# Altium project KlusterLab r2.0.PrjPcb (part 3 of 10)

## Sheet DDR3 Memory_SO-DIMM.SchDoc
size A3
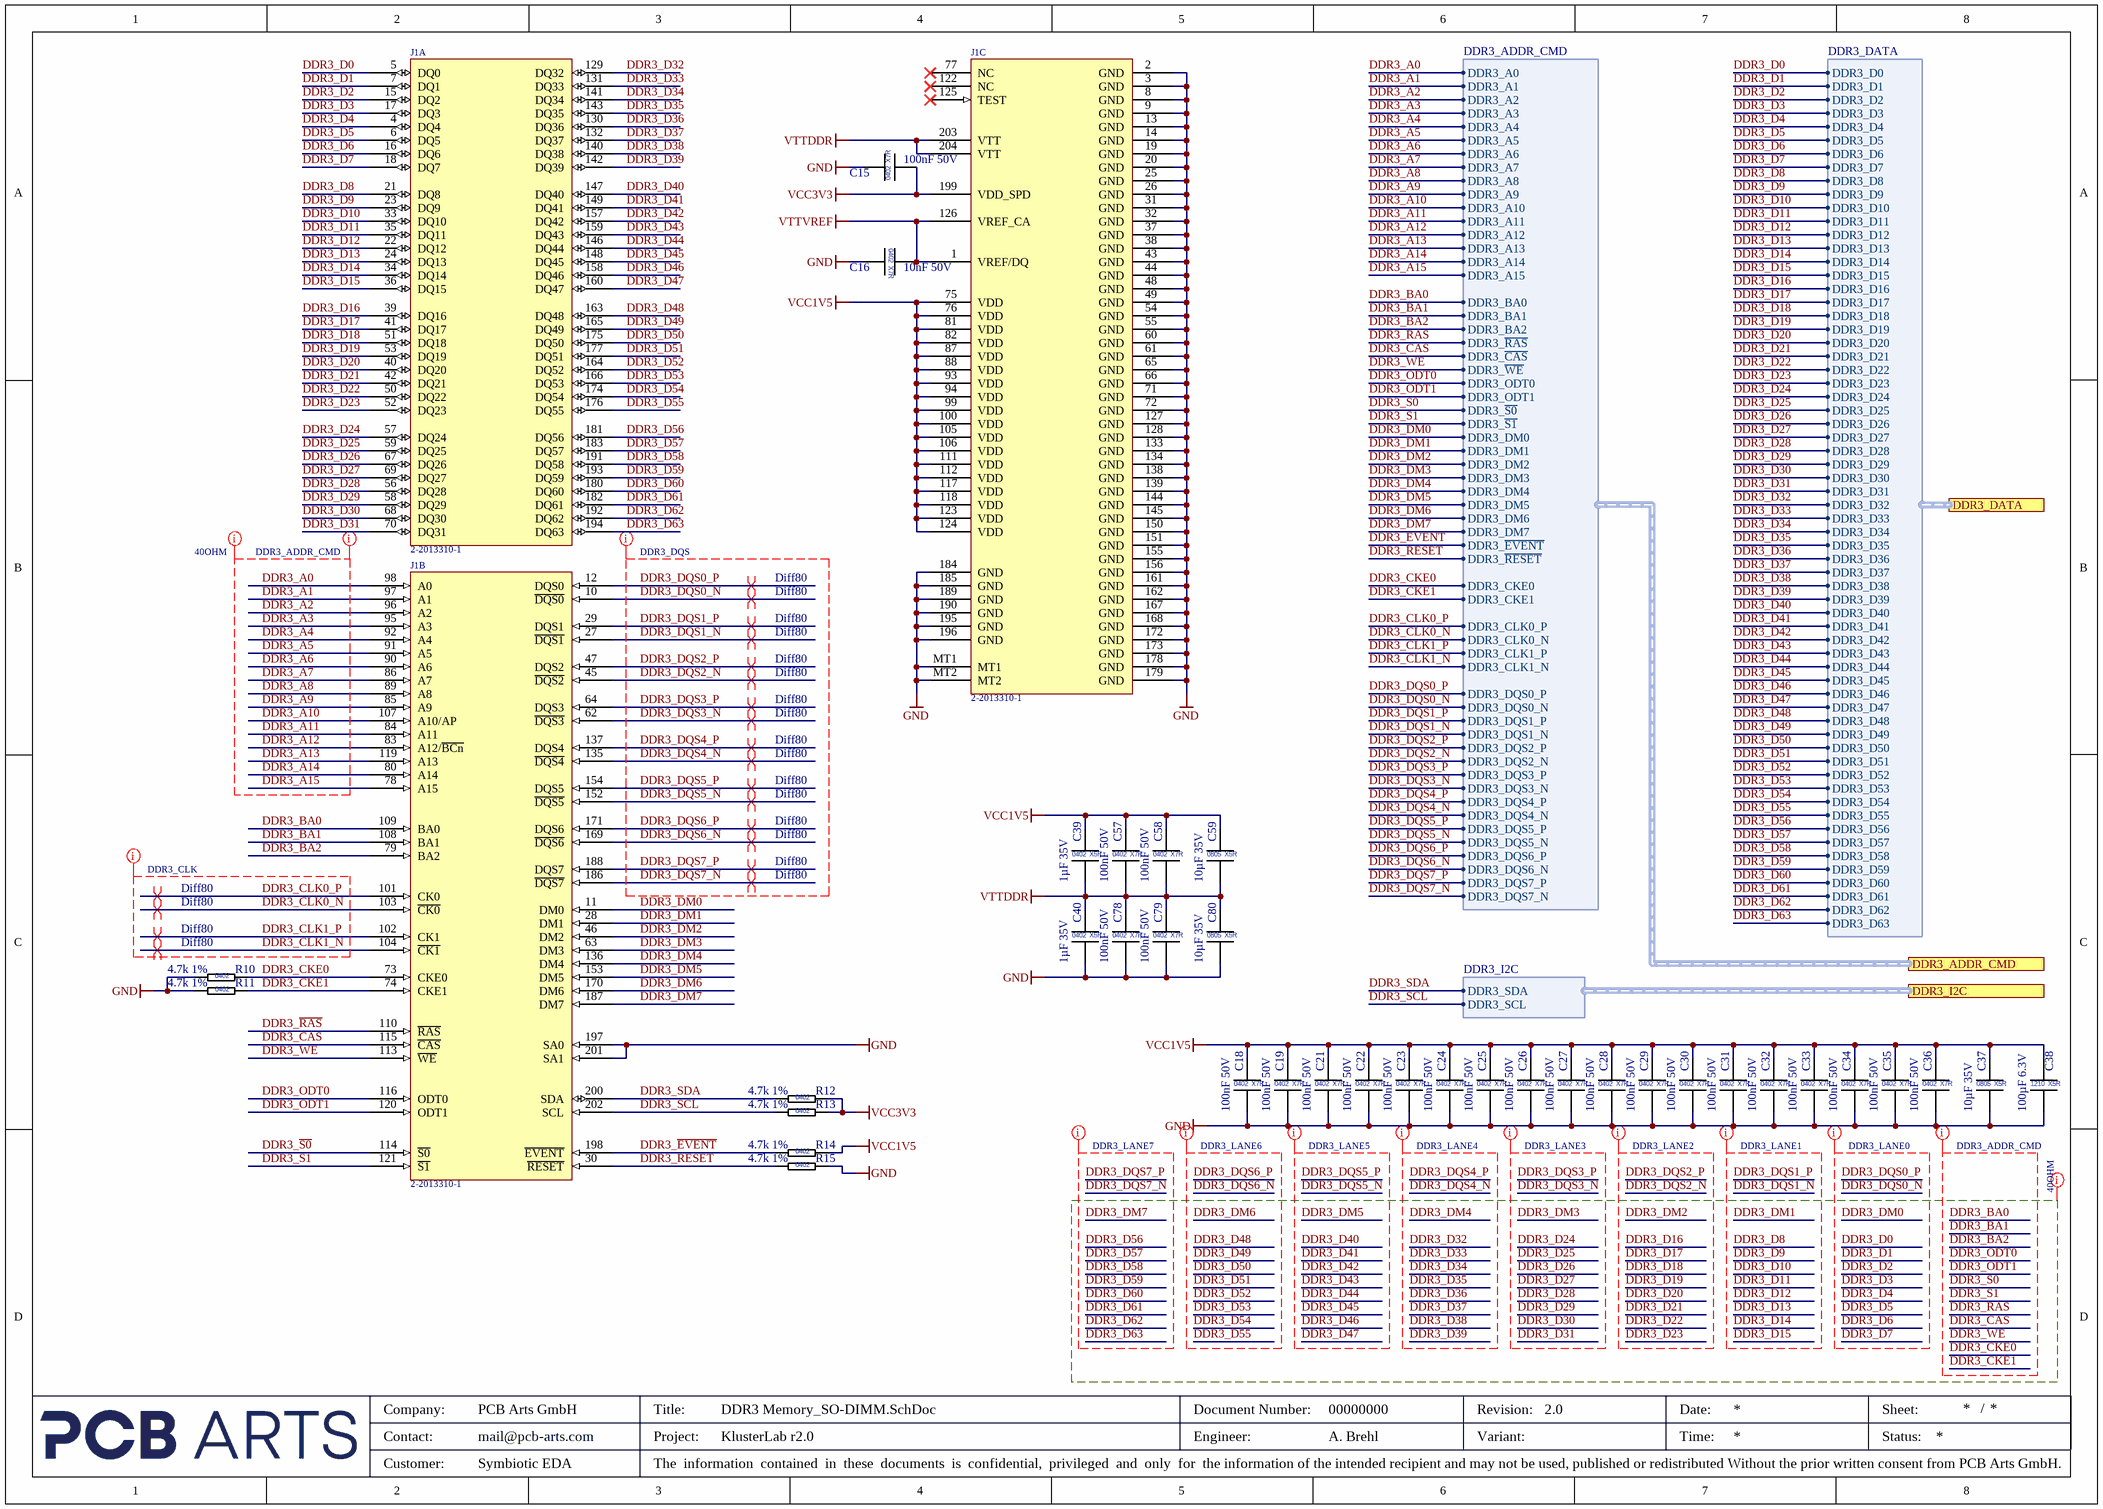
[diagram p4: DDR3 Memory_SO-DIMM.SchDoc]

### Parts
C15  100nF 50V  [CAP_0402_L]
C16  10nF 50V  [CAP_0402_L]
C18  100nF 50V  [CAP_0402_L]
C19  100nF 50V  [CAP_0402_L]
C21  100nF 50V  [CAP_0402_L]
C22  100nF 50V  [CAP_0402_L]
C23  100nF 50V  [CAP_0402_L]
C24  100nF 50V  [CAP_0402_L]
C25  100nF 50V  [CAP_0402_L]
C26  100nF 50V  [CAP_0402_L]
C27  100nF 50V  [CAP_0402_L]
C28  100nF 50V  [CAP_0402_L]
C29  100nF 50V  [CAP_0402_L]
C30  100nF 50V  [CAP_0402_L]
C31  100nF 50V  [CAP_0402_L]
C32  100nF 50V  [CAP_0402_L]
C33  100nF 50V  [CAP_0402_L]
C34  100nF 50V  [CAP_0402_L]
C35  100nF 50V  [CAP_0402_L]
C36  100nF 50V  [CAP_0402_L]
C37  10µF 35V  [CAP_0805]
C38  100µF 6.3V  [CAP_1210]
C39  1µF 35V  [CAP_0402_L]
C40  1µF 35V  [CAP_0402_L]
C57  100nF 50V  [CAP_0402_L]
C58  100nF 50V  [CAP_0402_L]
C59  10µF 35V  [CAP_0805]
C78  100nF 50V  [CAP_0402_L]
C79  100nF 50V  [CAP_0402_L]
C80  10µF 35V  [CAP_0805]
J1  2-2013310-1  [2-2013310-1]  (parts A,B,C of 3)
R10  4.7k 1%  [RES_0402_L]
R11  4.7k 1%  [RES_0402_L]
R12  4.7k 1%  [RES_0402_L]
R13  4.7k 1%  [RES_0402_L]
R14  4.7k 1%  [RES_0402_L]
R15  4.7k 1%  [RES_0402_L]

### Ports
DDR3_ADDR_CMD (harness DDR3_ADDR_CMD, see Top-Level-Sheet[6B], DDR3 Memory_Banks 32-33-34[8C]), DDR3_DATA (harness DDR3_DATA, see Top-Level-Sheet[6B], DDR3 Memory_Banks 32-33-34[8B]), DDR3_I2C (harness DDR3_I2C, see Top-Level-Sheet[6B], I2C Multiplexer[7A])

### Harnesses
DDR3_DATA: DDR3_D0, DDR3_D1, DDR3_D2, DDR3_D3, DDR3_D4, DDR3_D5, DDR3_D6, DDR3_D7, DDR3_D8, DDR3_D9, DDR3_D10, DDR3_D11, DDR3_D12, DDR3_D13, DDR3_D14, DDR3_D15, DDR3_D16, DDR3_D17, DDR3_D18, DDR3_D19, DDR3_D20, DDR3_D21, DDR3_D22, DDR3_D23, DDR3_D24, DDR3_D25, DDR3_D26, DDR3_D27, DDR3_D28, DDR3_D29, DDR3_D30, DDR3_D31, DDR3_D32, DDR3_D33, DDR3_D34, DDR3_D35, DDR3_D36, DDR3_D37, DDR3_D38, DDR3_D39, DDR3_D40, DDR3_D41, DDR3_D42, DDR3_D43, DDR3_D44, DDR3_D45, DDR3_D46, DDR3_D47, DDR3_D48, DDR3_D49, DDR3_D50, DDR3_D51, DDR3_D52, DDR3_D53, DDR3_D54, DDR3_D55, DDR3_D56, DDR3_D57, DDR3_D58, DDR3_D59, DDR3_D60, DDR3_D61, DDR3_D62, DDR3_D63
DDR3_ADDR_CMD: DDR3_A0, DDR3_BA0, DDR3_BA1, DDR3_BA2, DDR3_~{RAS}, DDR3_~{CAS}, DDR3_~{WE}, DDR3_ODT0, DDR3_ODT1, DDR3_~{S0}, DDR3_~{S1}, DDR3_DM0, DDR3_~{EVENT}, DDR3_~{RESET}, DDR3_CKE0, DDR3_CKE1, DDR3_CLK0_P, DDR3_CLK0_N, DDR3_CLK1_P, DDR3_CLK1_N, DDR3_DQS0_P, DDR3_DQS0_N, DDR3_DQS1_P, DDR3_DQS1_N, DDR3_DQS2_P, DDR3_DQS2_N, DDR3_DQS3_P, DDR3_DQS3_N, DDR3_DQS4_P, DDR3_DQS4_N, DDR3_DQS5_P, DDR3_DQS5_N, DDR3_DQS6_P, DDR3_DQS6_N, DDR3_DQS7_P, DDR3_DQS7_N, DDR3_A1, DDR3_A2, DDR3_A3, DDR3_A4, DDR3_A5, DDR3_A6, DDR3_A7, DDR3_A8, DDR3_A9, DDR3_A10, DDR3_A11, DDR3_A12, DDR3_A13, DDR3_A14, DDR3_A15, DDR3_DM1, DDR3_DM2, DDR3_DM3, DDR3_DM4, DDR3_DM5, DDR3_DM6, DDR3_DM7
DDR3_I2C: DDR3_SDA, DDR3_SCL

### Nets
GND: C15.1 C16.2 C18.2 C19.2 C21.2 C22.2 C23.2 C24.2 C25.2 C26.2 C27.2 C28.2 C29.2 C30.2 C31.2 C32.2 C33.2 C34.2 C35.2 C36.2 C37.2 C38.2 C40.2 C78.2 C79.2 C80.2 J1.2(GND) J1.3(GND) J1.8(GND) J1.9(GND) J1.13(GND) J1.14(GND) J1.19(GND) J1.20(GND) J1.25(GND) J1.26(GND) J1.31(GND) J1.32(GND) J1.37(GND) J1.38(GND) J1.43(GND) J1.44(GND) J1.48(GND) J1.49(GND) J1.54(GND) J1.55(GND) J1.60(GND) J1.61(GND) J1.65(GND) J1.66(GND) J1.71(GND) J1.72(GND) J1.127(GND) J1.128(GND) J1.133(GND) J1.134(GND) J1.138(GND) J1.139(GND) J1.144(GND) J1.145(GND) J1.150(GND) J1.151(GND) J1.155(GND) J1.156(GND) J1.161(GND) J1.162(GND) J1.167(GND) J1.168(GND) J1.172(GND) J1.173(GND) J1.178(GND) J1.179(GND) J1.184(GND) J1.185(GND) J1.189(GND) J1.190(GND) J1.195(GND) J1.196(GND) J1.197(SA0) J1.201(SA1) J1.MT1 J1.MT2 R10.1 R11.1 R15.2
VCC1V5: C18.1 C19.1 C21.1 C22.1 C23.1 C24.1 C25.1 C26.1 C27.1 C28.1 C29.1 C30.1 C31.1 C32.1 C33.1 C34.1 C35.1 C36.1 C37.1 C38.1 C39.1 C57.1 C58.1 C59.1 J1.75(VDD) J1.76(VDD) J1.81(VDD) J1.82(VDD) J1.87(VDD) J1.88(VDD) J1.93(VDD) J1.94(VDD) J1.99(VDD) J1.100(VDD) J1.105(VDD) J1.106(VDD) J1.111(VDD) J1.112(VDD) J1.117(VDD) J1.118(VDD) J1.123(VDD) J1.124(VDD) R14.2
VCC3V3: C15.2 J1.199(VDD_SPD) R12.2 R13.2
VTTDDR: C39.2 C40.1 C57.2 C58.2 C59.2 C78.1 C79.1 C80.1 J1.203(VTT) J1.204(VTT)
VTTVREF: C16.1 J1.1(VREF/DQ) J1.126(VREF_CA)
DDR3_A0: J1.98(A0) ; port DDR3_ADDR_CMD.DDR3_A0
DDR3_A1: J1.97(A1) ; port DDR3_ADDR_CMD.DDR3_A1
DDR3_A2: J1.96(A2) ; port DDR3_ADDR_CMD.DDR3_A2
DDR3_A3: J1.95(A3) ; port DDR3_ADDR_CMD.DDR3_A3
DDR3_A4: J1.92(A4) ; port DDR3_ADDR_CMD.DDR3_A4
DDR3_A5: J1.91(A5) ; port DDR3_ADDR_CMD.DDR3_A5
DDR3_A6: J1.90(A6) ; port DDR3_ADDR_CMD.DDR3_A6
DDR3_A7: J1.86(A7) ; port DDR3_ADDR_CMD.DDR3_A7
DDR3_A8: J1.89(A8) ; port DDR3_ADDR_CMD.DDR3_A8
DDR3_A9: J1.85(A9) ; port DDR3_ADDR_CMD.DDR3_A9
DDR3_A10: J1.107(A10/AP) ; port DDR3_ADDR_CMD.DDR3_A10
DDR3_A11: J1.84(A11) ; port DDR3_ADDR_CMD.DDR3_A11
DDR3_A12: J1.83(A12/~{BCn}) ; port DDR3_ADDR_CMD.DDR3_A12
DDR3_A13: J1.119(A13) ; port DDR3_ADDR_CMD.DDR3_A13
DDR3_A14: J1.80(A14) ; port DDR3_ADDR_CMD.DDR3_A14
DDR3_A15: J1.78(A15) ; port DDR3_ADDR_CMD.DDR3_A15
DDR3_BA0: J1.109(BA0) ; port DDR3_ADDR_CMD.DDR3_BA0
DDR3_BA1: J1.108(BA1) ; port DDR3_ADDR_CMD.DDR3_BA1
DDR3_BA2: J1.79(BA2) ; port DDR3_ADDR_CMD.DDR3_BA2
DDR3_~{CAS}: J1.115(~{CAS}) ; port DDR3_ADDR_CMD.DDR3_~{CAS}
DDR3_CKE0: J1.73(CKE0) R10.2 ; port DDR3_ADDR_CMD.DDR3_CKE0
DDR3_CKE1: J1.74(CKE1) R11.2 ; port DDR3_ADDR_CMD.DDR3_CKE1
DDR3_CLK0_N: J1.103(~{CK0}) ; port DDR3_ADDR_CMD.DDR3_CLK0_N
DDR3_CLK0_P: J1.101(CK0) ; port DDR3_ADDR_CMD.DDR3_CLK0_P
DDR3_CLK1_N: J1.104(~{CK1}) ; port DDR3_ADDR_CMD.DDR3_CLK1_N
DDR3_CLK1_P: J1.102(CK1) ; port DDR3_ADDR_CMD.DDR3_CLK1_P
DDR3_D0: J1.5(DQ0) ; port DDR3_DATA.DDR3_D0
DDR3_D1: J1.7(DQ1) ; port DDR3_DATA.DDR3_D1
DDR3_D2: J1.15(DQ2) ; port DDR3_DATA.DDR3_D2
DDR3_D3: J1.17(DQ3) ; port DDR3_DATA.DDR3_D3
DDR3_D4: J1.4(DQ4) ; port DDR3_DATA.DDR3_D4
DDR3_D5: J1.6(DQ5) ; port DDR3_DATA.DDR3_D5
DDR3_D6: J1.16(DQ6) ; port DDR3_DATA.DDR3_D6
DDR3_D7: J1.18(DQ7) ; port DDR3_DATA.DDR3_D7
DDR3_D8: J1.21(DQ8) ; port DDR3_DATA.DDR3_D8
DDR3_D9: J1.23(DQ9) ; port DDR3_DATA.DDR3_D9
DDR3_D10: J1.33(DQ10) ; port DDR3_DATA.DDR3_D10
DDR3_D11: J1.35(DQ11) ; port DDR3_DATA.DDR3_D11
DDR3_D12: J1.22(DQ12) ; port DDR3_DATA.DDR3_D12
DDR3_D13: J1.24(DQ13) ; port DDR3_DATA.DDR3_D13
DDR3_D14: J1.34(DQ14) ; port DDR3_DATA.DDR3_D14
DDR3_D15: J1.36(DQ15) ; port DDR3_DATA.DDR3_D15
DDR3_D16: J1.39(DQ16) ; port DDR3_DATA.DDR3_D16
DDR3_D17: J1.41(DQ17) ; port DDR3_DATA.DDR3_D17
DDR3_D18: J1.51(DQ18) ; port DDR3_DATA.DDR3_D18
DDR3_D19: J1.53(DQ19) ; port DDR3_DATA.DDR3_D19
DDR3_D20: J1.40(DQ20) ; port DDR3_DATA.DDR3_D20
DDR3_D21: J1.42(DQ21) ; port DDR3_DATA.DDR3_D21
DDR3_D22: J1.50(DQ22) ; port DDR3_DATA.DDR3_D22
DDR3_D23: J1.52(DQ23) ; port DDR3_DATA.DDR3_D23
DDR3_D24: J1.57(DQ24) ; port DDR3_DATA.DDR3_D24
DDR3_D25: J1.59(DQ25) ; port DDR3_DATA.DDR3_D25
DDR3_D26: J1.67(DQ26) ; port DDR3_DATA.DDR3_D26
DDR3_D27: J1.69(DQ27) ; port DDR3_DATA.DDR3_D27
DDR3_D28: J1.56(DQ28) ; port DDR3_DATA.DDR3_D28
DDR3_D29: J1.58(DQ29) ; port DDR3_DATA.DDR3_D29
DDR3_D30: J1.68(DQ30) ; port DDR3_DATA.DDR3_D30
DDR3_D31: J1.70(DQ31) ; port DDR3_DATA.DDR3_D31
DDR3_D32: J1.129(DQ32) ; port DDR3_DATA.DDR3_D32
DDR3_D33: J1.131(DQ33) ; port DDR3_DATA.DDR3_D33
DDR3_D34: J1.141(DQ34) ; port DDR3_DATA.DDR3_D34
DDR3_D35: J1.143(DQ35) ; port DDR3_DATA.DDR3_D35
DDR3_D36: J1.130(DQ36) ; port DDR3_DATA.DDR3_D36
DDR3_D37: J1.132(DQ37) ; port DDR3_DATA.DDR3_D37
DDR3_D38: J1.140(DQ38) ; port DDR3_DATA.DDR3_D38
DDR3_D39: J1.142(DQ39) ; port DDR3_DATA.DDR3_D39
DDR3_D40: J1.147(DQ40) ; port DDR3_DATA.DDR3_D40
DDR3_D41: J1.149(DQ41) ; port DDR3_DATA.DDR3_D41
DDR3_D42: J1.157(DQ42) ; port DDR3_DATA.DDR3_D42
DDR3_D43: J1.159(DQ43) ; port DDR3_DATA.DDR3_D43
DDR3_D44: J1.146(DQ44) ; port DDR3_DATA.DDR3_D44
DDR3_D45: J1.148(DQ45) ; port DDR3_DATA.DDR3_D45
DDR3_D46: J1.158(DQ46) ; port DDR3_DATA.DDR3_D46
DDR3_D47: J1.160(DQ47) ; port DDR3_DATA.DDR3_D47
DDR3_D48: J1.163(DQ48) ; port DDR3_DATA.DDR3_D48
DDR3_D49: J1.165(DQ49) ; port DDR3_DATA.DDR3_D49
DDR3_D50: J1.175(DQ50) ; port DDR3_DATA.DDR3_D50
DDR3_D51: J1.177(DQ51) ; port DDR3_DATA.DDR3_D51
DDR3_D52: J1.164(DQ52) ; port DDR3_DATA.DDR3_D52
DDR3_D53: J1.166(DQ53) ; port DDR3_DATA.DDR3_D53
DDR3_D54: J1.174(DQ54) ; port DDR3_DATA.DDR3_D54
DDR3_D55: J1.176(DQ55) ; port DDR3_DATA.DDR3_D55
DDR3_D56: J1.181(DQ56) ; port DDR3_DATA.DDR3_D56
DDR3_D57: J1.183(DQ57) ; port DDR3_DATA.DDR3_D57
DDR3_D58: J1.191(DQ58) ; port DDR3_DATA.DDR3_D58
DDR3_D59: J1.193(DQ59) ; port DDR3_DATA.DDR3_D59
DDR3_D60: J1.180(DQ60) ; port DDR3_DATA.DDR3_D60
DDR3_D61: J1.182(DQ61) ; port DDR3_DATA.DDR3_D61
DDR3_D62: J1.192(DQ62) ; port DDR3_DATA.DDR3_D62
DDR3_D63: J1.194(DQ63) ; port DDR3_DATA.DDR3_D63
DDR3_DM0: J1.11(DM0) ; port DDR3_ADDR_CMD.DDR3_DM0
DDR3_DM1: J1.28(DM1) ; port DDR3_ADDR_CMD.DDR3_DM1
DDR3_DM2: J1.46(DM2) ; port DDR3_ADDR_CMD.DDR3_DM2
DDR3_DM3: J1.63(DM3) ; port DDR3_ADDR_CMD.DDR3_DM3
DDR3_DM4: J1.136(DM4) ; port DDR3_ADDR_CMD.DDR3_DM4
DDR3_DM5: J1.153(DM5) ; port DDR3_ADDR_CMD.DDR3_DM5
DDR3_DM6: J1.170(DM6) ; port DDR3_ADDR_CMD.DDR3_DM6
DDR3_DM7: J1.187(DM7) ; port DDR3_ADDR_CMD.DDR3_DM7
DDR3_DQS0_N: J1.10(~{DQS0}) ; port DDR3_ADDR_CMD.DDR3_DQS0_N
DDR3_DQS0_P: J1.12(DQS0) ; port DDR3_ADDR_CMD.DDR3_DQS0_P
DDR3_DQS1_N: J1.27(~{DQS1}) ; port DDR3_ADDR_CMD.DDR3_DQS1_N
DDR3_DQS1_P: J1.29(DQS1) ; port DDR3_ADDR_CMD.DDR3_DQS1_P
DDR3_DQS2_N: J1.45(~{DQS2}) ; port DDR3_ADDR_CMD.DDR3_DQS2_N
DDR3_DQS2_P: J1.47(DQS2) ; port DDR3_ADDR_CMD.DDR3_DQS2_P
DDR3_DQS3_N: J1.62(~{DQS3}) ; port DDR3_ADDR_CMD.DDR3_DQS3_N
DDR3_DQS3_P: J1.64(DQS3) ; port DDR3_ADDR_CMD.DDR3_DQS3_P
DDR3_DQS4_N: J1.135(~{DQS4}) ; port DDR3_ADDR_CMD.DDR3_DQS4_N
DDR3_DQS4_P: J1.137(DQS4) ; port DDR3_ADDR_CMD.DDR3_DQS4_P
DDR3_DQS5_N: J1.152(~{DQS5}) ; port DDR3_ADDR_CMD.DDR3_DQS5_N
DDR3_DQS5_P: J1.154(DQS5) ; port DDR3_ADDR_CMD.DDR3_DQS5_P
DDR3_DQS6_N: J1.169(~{DQS6}) ; port DDR3_ADDR_CMD.DDR3_DQS6_N
DDR3_DQS6_P: J1.171(DQS6) ; port DDR3_ADDR_CMD.DDR3_DQS6_P
DDR3_DQS7_N: J1.186(~{DQS7}) ; port DDR3_ADDR_CMD.DDR3_DQS7_N
DDR3_DQS7_P: J1.188(DQS7) ; port DDR3_ADDR_CMD.DDR3_DQS7_P
DDR3_~{EVENT}: J1.198(~{EVENT}) R14.1 ; port DDR3_ADDR_CMD.DDR3_~{EVENT}
DDR3_ODT0: J1.116(ODT0) ; port DDR3_ADDR_CMD.DDR3_ODT0
DDR3_ODT1: J1.120(ODT1) ; port DDR3_ADDR_CMD.DDR3_ODT1
DDR3_~{RAS}: J1.110(~{RAS}) ; port DDR3_ADDR_CMD.DDR3_~{RAS}
DDR3_~{RESET}: J1.30(~{RESET}) R15.1 ; port DDR3_ADDR_CMD.DDR3_~{RESET}
DDR3_~{S0}: J1.114(~{S0}) ; port DDR3_ADDR_CMD.DDR3_~{S0}
DDR3_~{S1}: J1.121(~{S1}) ; port DDR3_ADDR_CMD.DDR3_~{S1}
DDR3_SCL: J1.202(SCL) R13.1 ; port DDR3_I2C.DDR3_SCL
DDR3_SDA: J1.200(SDA) R12.1 ; port DDR3_I2C.DDR3_SDA
DDR3_~{WE}: J1.113(~{WE}) ; port DDR3_ADDR_CMD.DDR3_~{WE}

Not connected (* = marked no-connect by the designer): J1 77(NC)* 122(NC)* 125(TEST)*

### Layout directives
differential pair; net class Diff80: DDR3_CLK0_N, DDR3_CLK0_P, DDR3_CLK1_N, DDR3_CLK1_P, DDR3_DQS0_N, DDR3_DQS0_P, DDR3_DQS1_N, DDR3_DQS1_P, DDR3_DQS2_N, DDR3_DQS2_P, DDR3_DQS3_N, DDR3_DQS3_P, DDR3_DQS4_N, DDR3_DQS4_P, DDR3_DQS5_N, DDR3_DQS5_P, DDR3_DQS6_N, DDR3_DQS6_P, DDR3_DQS7_N, DDR3_DQS7_P
net class DDR3_DQS: DDR3_DQS0_N, DDR3_DQS0_P, DDR3_DQS1_N, DDR3_DQS1_P, DDR3_DQS2_N, DDR3_DQS2_P, DDR3_DQS3_N, DDR3_DQS3_P, DDR3_DQS4_N, DDR3_DQS4_P, DDR3_DQS5_N, DDR3_DQS5_P, DDR3_DQS6_N, DDR3_DQS6_P, DDR3_DQS7_N, DDR3_DQS7_P
net class DDR3_LANE1: DDR3_D8, DDR3_D9, DDR3_D10, DDR3_D11, DDR3_D12, DDR3_D13, DDR3_D14, DDR3_D15, DDR3_DM1, DDR3_DQS1_N, DDR3_DQS1_P
net class DDR3_LANE2: DDR3_D16, DDR3_D17, DDR3_D18, DDR3_D19, DDR3_D20, DDR3_D21, DDR3_D22, DDR3_D23, DDR3_DM2, DDR3_DQS2_N, DDR3_DQS2_P
net class DDR3_LANE3: DDR3_D24, DDR3_D25, DDR3_D26, DDR3_D27, DDR3_D28, DDR3_D29, DDR3_D30, DDR3_D31, DDR3_DM3, DDR3_DQS3_N, DDR3_DQS3_P
net class DDR3_LANE4: DDR3_D32, DDR3_D33, DDR3_D34, DDR3_D35, DDR3_D36, DDR3_D37, DDR3_D38, DDR3_D39, DDR3_DM4, DDR3_DQS4_N, DDR3_DQS4_P
net class DDR3_LANE5: DDR3_D40, DDR3_D41, DDR3_D42, DDR3_D43, DDR3_D44, DDR3_D45, DDR3_D46, DDR3_D47, DDR3_DM5, DDR3_DQS5_N, DDR3_DQS5_P
net class DDR3_LANE6: DDR3_D48, DDR3_D49, DDR3_D50, DDR3_D51, DDR3_D52, DDR3_D53, DDR3_D54, DDR3_D55, DDR3_DM6, DDR3_DQS6_N, DDR3_DQS6_P
net class DDR3_LANE7: DDR3_D56, DDR3_D57, DDR3_D58, DDR3_D59, DDR3_D60, DDR3_D61, DDR3_D62, DDR3_D63, DDR3_DM7, DDR3_DQS7_N, DDR3_DQS7_P
net class 40OHM: DDR3_A0, DDR3_A1, DDR3_A2, DDR3_A3, DDR3_A4, DDR3_A5, DDR3_A6, DDR3_A7, DDR3_A8, DDR3_A9, DDR3_A10, DDR3_A11, DDR3_A12, DDR3_A13, DDR3_A14, DDR3_A15, DDR3_BA0, DDR3_BA1, DDR3_BA2, DDR3_CKE0, DDR3_CKE1, DDR3_D0, DDR3_D1, DDR3_D2, DDR3_D3, DDR3_D4, DDR3_D5, DDR3_D6, DDR3_D7, DDR3_D8, DDR3_D9, DDR3_D10, DDR3_D11, DDR3_D12, DDR3_D13, DDR3_D14, DDR3_D15, DDR3_D16, DDR3_D17, DDR3_D18, DDR3_D19, DDR3_D20, DDR3_D21, DDR3_D22, DDR3_D23, DDR3_D24, DDR3_D25, DDR3_D26, DDR3_D27, DDR3_D28, DDR3_D29, DDR3_D30, DDR3_D31, DDR3_D32, DDR3_D33, DDR3_D34, DDR3_D35, DDR3_D36, DDR3_D37, DDR3_D38, DDR3_D39, DDR3_D40, DDR3_D41, DDR3_D42, DDR3_D43, DDR3_D44, DDR3_D45, DDR3_D46, DDR3_D47, DDR3_D48, DDR3_D49, DDR3_D50, DDR3_D51, DDR3_D52, DDR3_D53, DDR3_D54, DDR3_D55, DDR3_D56, DDR3_D57, DDR3_D58, DDR3_D59, DDR3_D60, DDR3_D61, DDR3_D62, DDR3_D63, DDR3_DM0, DDR3_DM1, DDR3_DM2, DDR3_DM3, DDR3_DM4, DDR3_DM5, DDR3_DM6, DDR3_DM7, DDR3_ODT0, DDR3_ODT1, DDR3_~{CAS}, DDR3_~{RAS}, DDR3_~{S0}, DDR3_~{S1}, DDR3_~{WE}
net class DDR3_ADDR_CMD: DDR3_A0, DDR3_A1, DDR3_A2, DDR3_A3, DDR3_A4, DDR3_A5, DDR3_A6, DDR3_A7, DDR3_A8, DDR3_A9, DDR3_A10, DDR3_A11, DDR3_A12, DDR3_A13, DDR3_A14, DDR3_A15, DDR3_BA0, DDR3_BA1, DDR3_BA2, DDR3_CKE0, DDR3_CKE1, DDR3_ODT0, DDR3_ODT1, DDR3_~{CAS}, DDR3_~{RAS}, DDR3_~{S0}, DDR3_~{S1}, DDR3_~{WE}
net class DDR3_CLK: DDR3_CLK0_N, DDR3_CLK0_P, DDR3_CLK1_N, DDR3_CLK1_P
net class DDR3_LANE0: DDR3_D0, DDR3_D1, DDR3_D2, DDR3_D3, DDR3_D4, DDR3_D5, DDR3_D6, DDR3_D7, DDR3_DM0, DDR3_DQS0_N, DDR3_DQS0_P

### Notes on the sheet
- Company:
- Contact:
- Customer:
- mail@pcb-arts.com
- PCB Arts GmbH
- Title:
- Project:
- The  information  contained  in  these  documents  is  confidential,  privileged  and  only  for  the information of the intended recipient and may not be used, published or redistributed Without the prior written consent from PCB Arts GmbH.
- Engineer:
- Document Number:
- Revision:
- Variant:
- Date:
- Time:
- Sheet:
- Status:
- /
- (in symbol CAP_0402_1µF_35V) 0402; X5R
- (in symbol CAP_0402_10nF_50V) 0402; X7R
- (in symbol CAP_0402_100nF_50V) 0402; X7R
- (in symbol CAP_0805_10µF_35V) 0805; X5R
- (in symbol CAP_1210_100µF_6.3V) 1210; X5R
- (in symbol RES_0402_4.7k_1%) 0402

### Library data of the parts
C15 C18 C19 C21-C36 C57 C58 C78 C79 = CAP_0402_100nF_50V: Multilayer Ceramic Capacitors MLCC - SMD/SMT 0402 50VDC; Manufacturer 1: Murata Electronics; Manufacturer 1 Prt. Nr.: GCM155L8EH104KE07D; Manufacturer 2 Prt. Nr.: UMK105B7104KV-FR; Manufacturer 2: TDK
C16 = CAP_0402_10nF_50V: Multilayer Ceramic Capacitors MLCC - SMD/SMT 0402 50VDC; Manufacturer 1: Wurth Elektronik; Manufacturer 1 Prt. Nr.: 885012205067; Manufacturer 2 Prt. Nr.: AC0402KPX7R9BB103; Manufacturer 2: Yageo
C37 C59 C80 = CAP_0805_10µF_35V: Multilayer Ceramic Capacitors MLCC - SMD/SMT 0805 35VDC; Manufacturer 1: Murata Electronics; Manufacturer 1 Prt. Nr.: GRM21BR6YA106ME43L; Manufacturer 2 Prt. Nr.: C2012X5R1V106M085AC; Manufacturer 2: TDK
C38 = CAP_1210_100µF_6.3V: Multilayer Ceramic Capacitors MLCC - SMD/SMT 1210 6.3VDC; Manufacturer 1: Samsung Electro-Mechanics; Manufacturer 1 Prt. Nr.: CL32A107MQVNNWE; Manufacturer 2 Prt. Nr.: JMK325ABJ107MMHP; Manufacturer 2: Taiyo Yuden
C39 C40 = CAP_0402_1µF_35V: Multilayer Ceramic Capacitors MLCC - SMD/SMT 0402 35VDC; Manufacturer 1: Kyocera Electronic Components; Manufacturer 1 Prt. Nr.: CM05X5R105K35AH; Manufacturer 2 Prt. Nr.: C1005X5R1V105K050BC; Manufacturer 2: TDK
J1 = 2-2013310-1_SO-DIMM DDR3 204P 9.2H STD Connector: SO-DIMM DDR3 204P 9.2H STD Connector; Manufacturer 1: TE Connectivity; Manufacturer 1 Prt. Nr.: 2-2013310-1
R10-R15 = RES_0402_4.7k_1%: Thick Film Resistors - SMD 4.7kOhm 1%; Manufacturer 1: Vishay / Dale; Manufacturer 1 Prt. Nr.: CRCW04024K70FKEDC; Manufacturer 2 Prt. Nr.: RC0402FR-134K7L; Manufacturer 2: Yageo

## Sheet FPGA_HDMI_IN_OUT.SchDoc
size A3; SheetNumber: 8; SheetTotal: 22
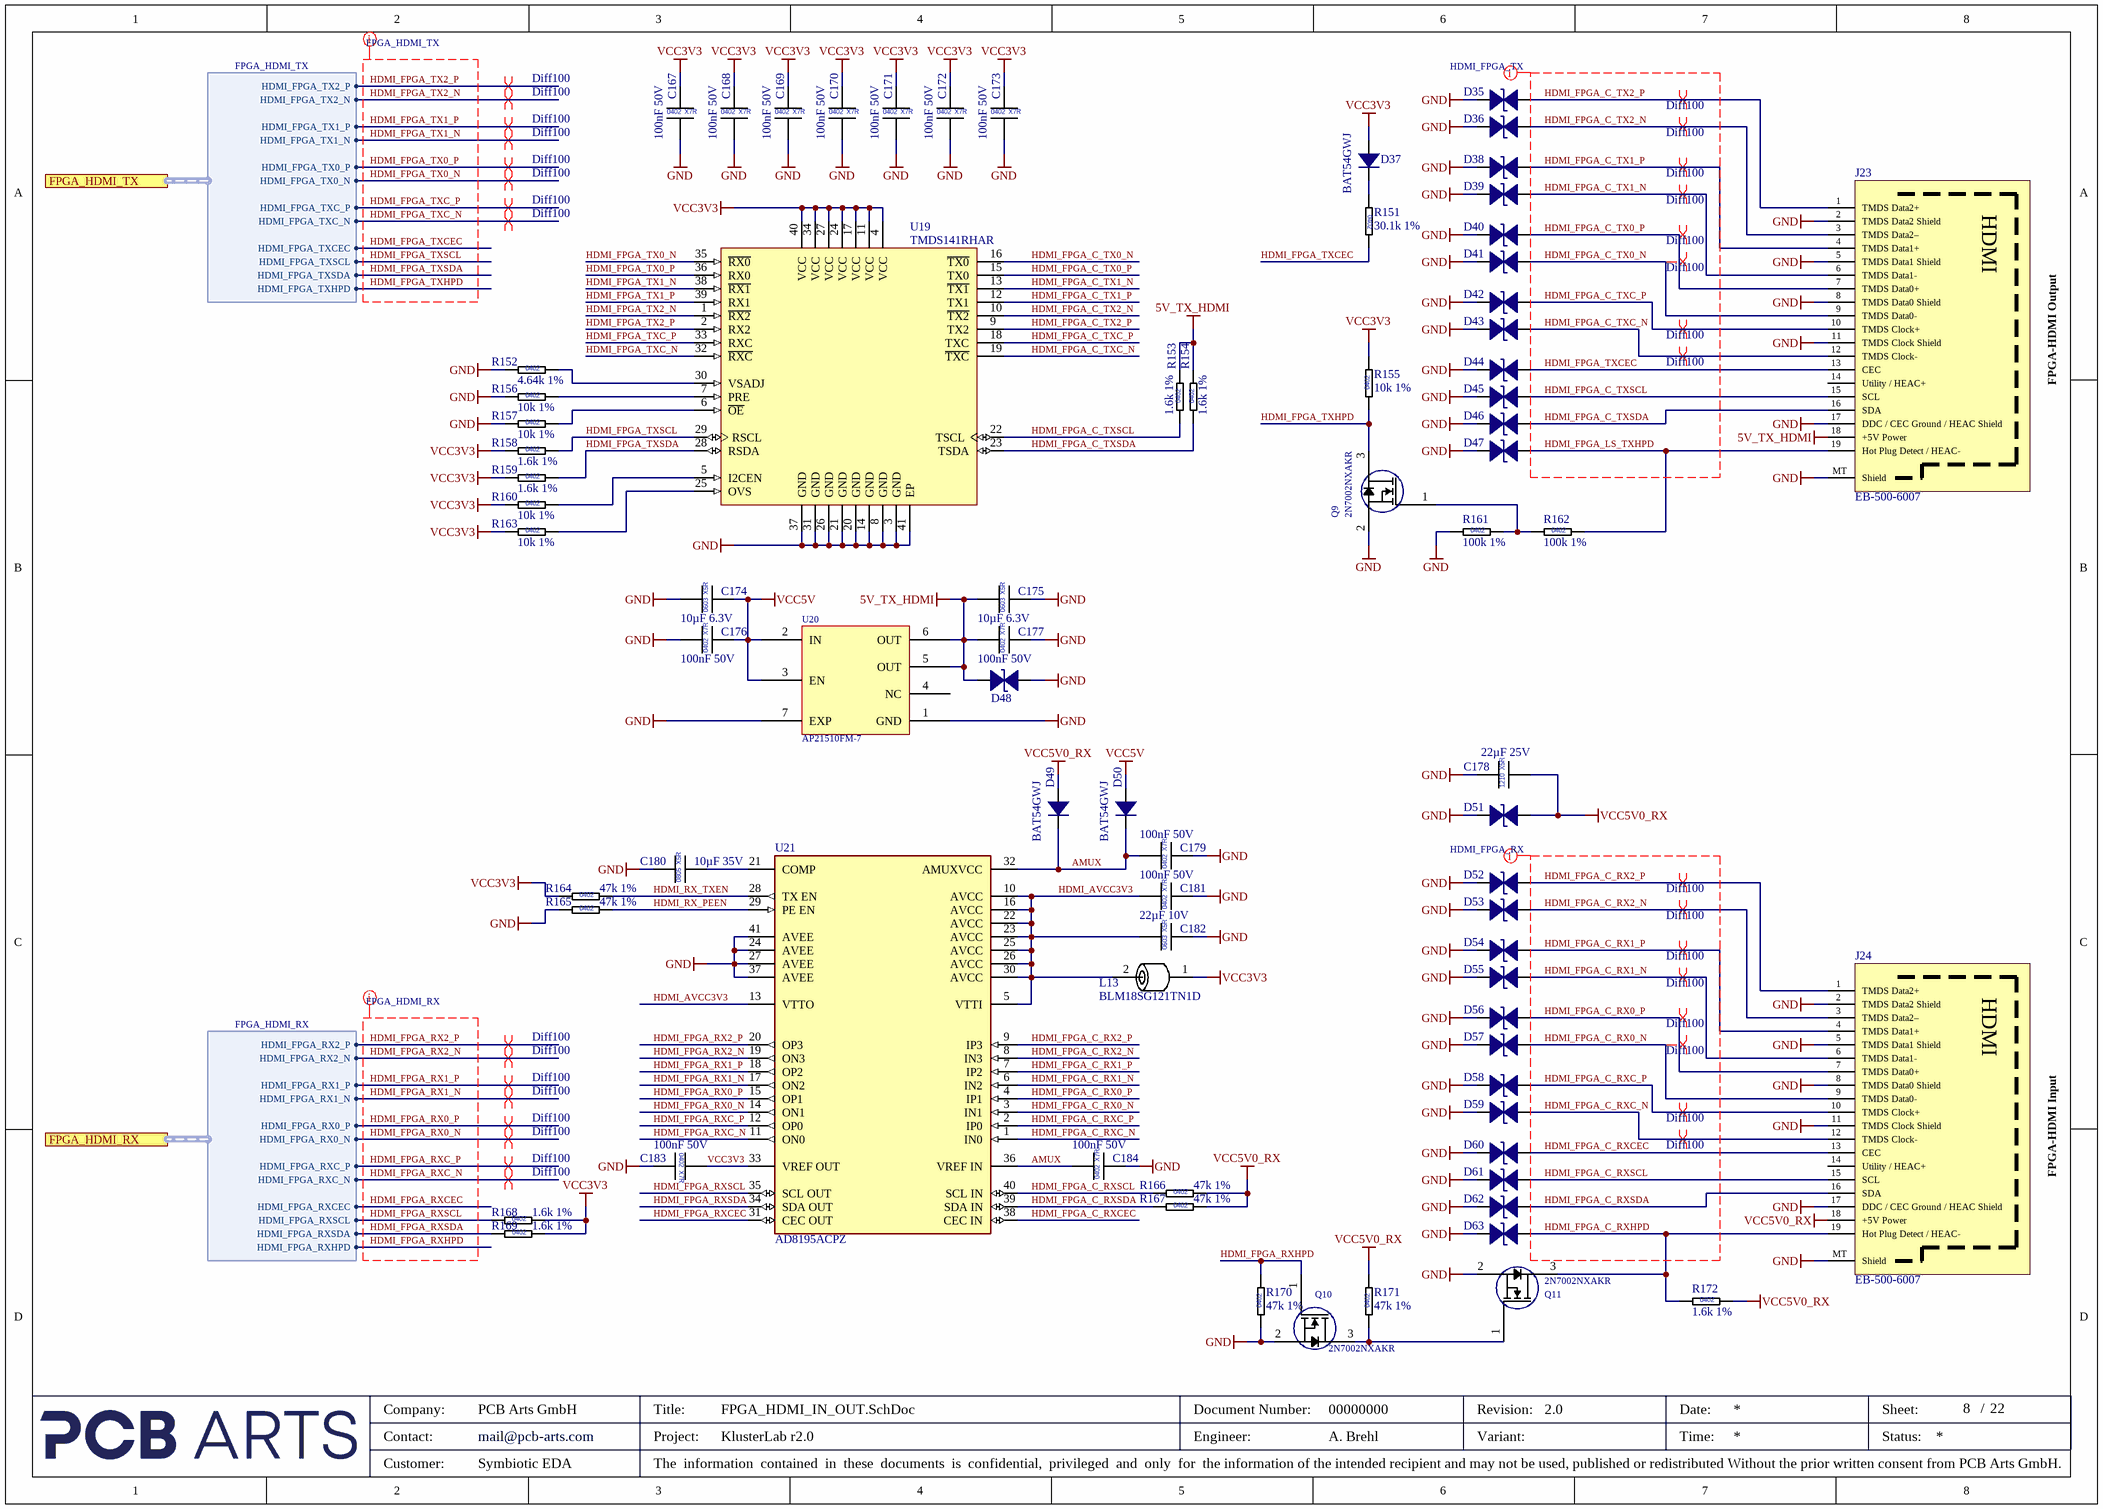
[diagram p5: FPGA_HDMI_IN_OUT.SchDoc]

### Parts
C167  100nF 50V  [CAP_0402_L]
C168  100nF 50V  [CAP_0402_L]
C169  100nF 50V  [CAP_0402_L]
C170  100nF 50V  [CAP_0402_L]
C171  100nF 50V  [CAP_0402_L]
C172  100nF 50V  [CAP_0402_L]
C173  100nF 50V  [CAP_0402_L]
C174  10µF 6.3V  [CAP_0603_L]
C175  10µF 6.3V  [CAP_0603_L]
C176  100nF 50V  [CAP_0402_L]
C177  100nF 50V  [CAP_0402_L]
C178  22µF 25V  [CAP_1210]
C179  100nF 50V  [CAP_0402_L]
C180  10µF 35V  [CAP_0805]
C181  100nF 50V  [CAP_0402_L]
C182  22µF 10V  [CAP_0603_L]
C183  100nF 50V  [CAP_0402_L]
C184  100nF 50V  [CAP_0402_L]
D35  CESDP0402UC5VB  [TVS_0402]  (value not drawn)
D36  CESDP0402UC5VB  [TVS_0402]  (value not drawn)
D37  BAT54GWJ  [SOD123]
D38  CESDP0402UC5VB  [TVS_0402]  (value not drawn)
D39  CESDP0402UC5VB  [TVS_0402]  (value not drawn)
D40  CESDP0402UC5VB  [TVS_0402]  (value not drawn)
D41  CESDP0402UC5VB  [TVS_0402]  (value not drawn)
D42  CESDP0402UC5VB  [TVS_0402]  (value not drawn)
D43  CESDP0402UC5VB  [TVS_0402]  (value not drawn)
D44  CESDP0402UC5VB  [TVS_0402]  (value not drawn)
D45  CESDP0402UC5VB  [TVS_0402]  (value not drawn)
D46  CESDP0402UC5VB  [TVS_0402]  (value not drawn)
D47  CESDP0402UC5VB  [TVS_0402]  (value not drawn)
D48  CESDP0402UC5VB  [TVS_0402]  (value not drawn)
D49  BAT54GWJ  [SOD123]
D50  BAT54GWJ  [SOD123]
D51  CESDP0402UC5VB  [TVS_0402]  (value not drawn)
D52  CESDP0402UC5VB  [TVS_0402]  (value not drawn)
D53  CESDP0402UC5VB  [TVS_0402]  (value not drawn)
D54  CESDP0402UC5VB  [TVS_0402]  (value not drawn)
D55  CESDP0402UC5VB  [TVS_0402]  (value not drawn)
D56  CESDP0402UC5VB  [TVS_0402]  (value not drawn)
D57  CESDP0402UC5VB  [TVS_0402]  (value not drawn)
D58  CESDP0402UC5VB  [TVS_0402]  (value not drawn)
D59  CESDP0402UC5VB  [TVS_0402]  (value not drawn)
D60  CESDP0402UC5VB  [TVS_0402]  (value not drawn)
D61  CESDP0402UC5VB  [TVS_0402]  (value not drawn)
D62  CESDP0402UC5VB  [TVS_0402]  (value not drawn)
D63  CESDP0402UC5VB  [TVS_0402]  (value not drawn)
J23  EB-500-6007  [Elecbee EB-500-6007]
J24  EB-500-6007  [Elecbee EB-500-6007]
L13  BLM18SG121TN1D  [L_0603]
Q9  2N7002NXAKR  [SOT95P251X112-3N]
Q10  2N7002NXAKR  [SOT95P251X112-3N]
Q11  2N7002NXAKR  [SOT95P251X112-3N]
R151  30.1k 1%  [RES_0402_L]
R152  4.64k 1%  [RES_0402_L]
R153  1.6k 1%  [RES_0402_L]
R154  1.6k 1%  [RES_0402_L]
R155  10k 1%  [RES_0402_L]
R156  10k 1%  [RES_0402_L]
R157  10k 1%  [RES_0402_L]
R158  1.6k 1%  [RES_0402_L]
R159  1.6k 1%  [RES_0402_L]
R160  10k 1%  [RES_0402_L]
R161  100k 1%  [RES_0402_L]
R162  100k 1%  [RES_0402_L]
R163  10k 1%  [RES_0402_L]
R164  47k 1%  [RES_0402_L]
R165  47k 1%  [RES_0402_L]
R166  47k 1%  [RES_0402_L]
R167  47k 1%  [RES_0402_L]
R168  1.6k 1%  [RES_0402_L]
R169  1.6k 1%  [RES_0402_L]
R170  47k 1%  [RES_0402_L]
R171  47k 1%  [RES_0402_L]
R172  1.6k 1%  [RES_0402_L]
U19  TMDS141RHAR  [QFN50P600X600X100-41N]
U20  AP21510FM-7  [QFN50P201X181X60_HS-7N]
U21  AD8195ACPZ  [QFN50P600X600X100-41N]

### Ports
FPGA_HDMI_RX (harness FPGA_HDMI_RX, see Top-Level-Sheet[6B], Bank 13_Bank 15_Bank 16[8B]), FPGA_HDMI_TX (harness FPGA_HDMI_TX, see Top-Level-Sheet[6B], Bank 13_Bank 15_Bank 16[8A])

### Harnesses
FPGA_HDMI_TX: HDMI_FPGA_TX2_P, HDMI_FPGA_TX2_N, HDMI_FPGA_TX1_P, HDMI_FPGA_TX1_N, HDMI_FPGA_TX0_P, HDMI_FPGA_TX0_N, HDMI_FPGA_TXC_P, HDMI_FPGA_TXC_N, HDMI_FPGA_TXCEC, HDMI_FPGA_TXSCL, HDMI_FPGA_TXSDA, HDMI_FPGA_TXHPD
FPGA_HDMI_RX: HDMI_FPGA_RX2_P, HDMI_FPGA_RX2_N, HDMI_FPGA_RX1_P, HDMI_FPGA_RX1_N, HDMI_FPGA_RX0_P, HDMI_FPGA_RX0_N, HDMI_FPGA_RXC_P, HDMI_FPGA_RXC_N, HDMI_FPGA_RXCEC, HDMI_FPGA_RXSCL, HDMI_FPGA_RXSDA, HDMI_FPGA_RXHPD

### Nets
5V_TX_HDMI: C175.1 C177.1 D48.1 J23.18(+5V_Power) R153.2 R154.2 U20.5(OUT) U20.6(OUT)
GND: C167.2 C168.2 C169.2 C170.2 C171.2 C172.2 C173.2 C174.1 C175.2 C176.1 C177.2 C178.1 C179.2 C180.1 C181.2 C182.2 C183.2 C184.2 D35.1 D36.1 D38.1 D39.1 D40.1 D41.1 D42.1 D43.1 D44.1 D45.1 D46.1 D47.1 D48.2 D51.1 D52.1 D53.1 D54.1 D55.1 D56.1 D57.1 D58.1 D59.1 D60.1 D61.1 D62.1 D63.1 J23.2(TMDS_Data2_Shield) J23.5(TMDS_Data1_Shield) J23.8(TMDS_Data0_Shield) J23.11(TMDS_Clock_Shield) J23.17(DDC_/_CEC_Ground_/_HEAC_Shield) J23.MT(Shield) J24.2(TMDS_Data2_Shield) J24.5(TMDS_Data1_Shield) J24.8(TMDS_Data0_Shield) J24.11(TMDS_Clock_Shield) J24.17(DDC_/_CEC_Ground_/_HEAC_Shield) J24.MT(Shield) Q9.2(S) Q10.2(S) Q11.2(S) R152.1 R156.1 R157.1 R161.1 R165.1 R170.1 U19.3(GND) U19.8(GND) U19.14(GND) U19.20(GND) U19.21(GND) U19.26(GND) U19.31(GND) U19.37(GND) U19.41(EP) U20.1(GND) U20.7(EXP) U21.24(AVEE) U21.27(AVEE) U21.37(AVEE) U21.41(AVEE)
VCC3V3: C167.1 C168.1 C169.1 C170.1 C171.1 C172.1 C173.1 C183.1 D37.2 L13.1 R155.2 R158.1 R159.1 R160.1 R163.1 R164.1 R168.2 R169.2 U19.4(VCC) U19.11(VCC) U19.17(VCC) U19.24(VCC) U19.27(VCC) U19.34(VCC) U19.40(VCC) U21.33(VREF_OUT)
VCC5V: C174.2 C176.2 D50.2 U20.2(IN) U20.3(EN)
VCC5V0_RX: C178.2 D49.2 D51.2 J24.18(+5V_Power) R166.2 R167.2 R171.2 R172.2
AMUX: C179.1 C184.1 D49.1 D50.1 U21.32(AMUXVCC) U21.36(VREF_IN)
HDMI_AVCC3V3: C181.1 C182.1 L13.2 U21.5(VTTI) U21.10(AVCC) U21.13(VTTO) U21.16(AVCC) U21.22(AVCC) U21.23(AVCC) U21.25(AVCC) U21.26(AVCC) U21.30(AVCC)
HDMI_FPGA_C_RX0_N: D57.2 J24.9(TMDS_Data0-) U21.3(IN1)
HDMI_FPGA_C_RX0_P: D56.2 J24.7(TMDS_Data0+) U21.4(IP1)
HDMI_FPGA_C_RX1_N: D55.2 J24.6(TMDS_Data1-) U21.6(IN2)
HDMI_FPGA_C_RX1_P: D54.2 J24.4(TMDS_Data1+) U21.7(IP2)
HDMI_FPGA_C_RX2_N: D53.2 J24.3(TMDS_Data2–) U21.8(IN3)
HDMI_FPGA_C_RX2_P: D52.2 J24.1(TMDS_Data2+) U21.9(IP3)
HDMI_FPGA_C_RXC_N: D59.2 J24.12(TMDS_Clock-) U21.1(IN0)
HDMI_FPGA_C_RXC_P: D58.2 J24.10(TMDS_Clock+) U21.2(IP0)
HDMI_FPGA_C_RXCEC: D60.2 J24.13(CEC) U21.38(CEC_IN)
HDMI_FPGA_C_RXHPD: D63.2 J24.19(Hot_Plug_Detect_/_HEAC-) Q11.3(D) R172.1
HDMI_FPGA_C_RXSCL: D61.2 J24.15(SCL) R166.1 U21.40(SCL_IN)
HDMI_FPGA_C_RXSDA: D62.2 J24.16(SDA) R167.1 U21.39(SDA_IN)
HDMI_FPGA_C_TX0_N: D41.2 J23.9(TMDS_Data0-) U19.16(~{TX0})
HDMI_FPGA_C_TX0_P: D40.2 J23.7(TMDS_Data0+) U19.15(TX0)
HDMI_FPGA_C_TX1_N: D39.2 J23.6(TMDS_Data1-) U19.13(~{TX1})
HDMI_FPGA_C_TX1_P: D38.2 J23.4(TMDS_Data1+) U19.12(TX1)
HDMI_FPGA_C_TX2_N: D36.2 J23.3(TMDS_Data2–) U19.10(~{TX2})
HDMI_FPGA_C_TX2_P: D35.2 J23.1(TMDS_Data2+) U19.9(TX2)
HDMI_FPGA_C_TXC_N: D43.2 J23.12(TMDS_Clock-) U19.19(~{TXC})
HDMI_FPGA_C_TXC_P: D42.2 J23.10(TMDS_Clock+) U19.18(TXC)
HDMI_FPGA_C_TXSCL: D45.2 J23.15(SCL) R153.1 U19.22(TSCL)
HDMI_FPGA_C_TXSDA: D46.2 J23.16(SDA) R154.1 U19.23(TSDA)
HDMI_FPGA_LS_TXHPD: D47.2 J23.19(Hot_Plug_Detect_/_HEAC-) R162.2
HDMI_FPGA_RX0_N: U21.14(ON1) ; port FPGA_HDMI_RX.HDMI_FPGA_RX0_N
HDMI_FPGA_RX0_P: U21.15(OP1) ; port FPGA_HDMI_RX.HDMI_FPGA_RX0_P
HDMI_FPGA_RX1_N: U21.17(ON2) ; port FPGA_HDMI_RX.HDMI_FPGA_RX1_N
HDMI_FPGA_RX1_P: U21.18(OP2) ; port FPGA_HDMI_RX.HDMI_FPGA_RX1_P
HDMI_FPGA_RX2_N: U21.19(ON3) ; port FPGA_HDMI_RX.HDMI_FPGA_RX2_N
HDMI_FPGA_RX2_P: U21.20(OP3) ; port FPGA_HDMI_RX.HDMI_FPGA_RX2_P
HDMI_FPGA_RXC_N: U21.11(ON0) ; port FPGA_HDMI_RX.HDMI_FPGA_RXC_N
HDMI_FPGA_RXC_P: U21.12(OP0) ; port FPGA_HDMI_RX.HDMI_FPGA_RXC_P
HDMI_FPGA_RXCEC: U21.31(CEC_OUT) ; port FPGA_HDMI_RX.HDMI_FPGA_RXCEC
HDMI_FPGA_RXHPD: Q10.1(G) R170.2 ; port FPGA_HDMI_RX.HDMI_FPGA_RXHPD
HDMI_FPGA_RXSCL: R168.1 U21.35(SCL_OUT) ; port FPGA_HDMI_RX.HDMI_FPGA_RXSCL
HDMI_FPGA_RXSDA: R169.1 U21.34(SDA_OUT) ; port FPGA_HDMI_RX.HDMI_FPGA_RXSDA
HDMI_FPGA_TX0_N: U19.35(~{RX0}) ; port FPGA_HDMI_TX.HDMI_FPGA_TX0_N
HDMI_FPGA_TX0_P: U19.36(RX0) ; port FPGA_HDMI_TX.HDMI_FPGA_TX0_P
HDMI_FPGA_TX1_N: U19.38(~{RX1}) ; port FPGA_HDMI_TX.HDMI_FPGA_TX1_N
HDMI_FPGA_TX1_P: U19.39(RX1) ; port FPGA_HDMI_TX.HDMI_FPGA_TX1_P
HDMI_FPGA_TX2_N: U19.1(~{RX2}) ; port FPGA_HDMI_TX.HDMI_FPGA_TX2_N
HDMI_FPGA_TX2_P: U19.2(RX2) ; port FPGA_HDMI_TX.HDMI_FPGA_TX2_P
HDMI_FPGA_TXC_N: U19.32(~{RXC}) ; port FPGA_HDMI_TX.HDMI_FPGA_TXC_N
HDMI_FPGA_TXC_P: U19.33(RXC) ; port FPGA_HDMI_TX.HDMI_FPGA_TXC_P
HDMI_FPGA_TXCEC: D44.2 J23.13(CEC) R151.2 ; port FPGA_HDMI_TX.HDMI_FPGA_TXCEC
HDMI_FPGA_TXHPD: Q9.3(D) R155.1 ; port FPGA_HDMI_TX.HDMI_FPGA_TXHPD
HDMI_FPGA_TXSCL: R158.2 U19.29(RSCL) ; port FPGA_HDMI_TX.HDMI_FPGA_TXSCL
HDMI_FPGA_TXSDA: R159.2 U19.28(RSDA) ; port FPGA_HDMI_TX.HDMI_FPGA_TXSDA
HDMI_RX_PEEN: R165.2 U21.29(PE_EN)
HDMI_RX_TXEN: R164.2 U21.28(TX_EN)
NetC180_2: C180.2 U21.21(COMP)
NetD37_1: D37.1 R151.1
NetQ9_1: Q9.1(G) R161.2 R162.1
NetQ10_3: Q10.3(D) Q11.1(G) R171.1
NetR152_2: R152.2 U19.30(VSADJ)
NetR156_2: R156.2 U19.7(PRE)
NetR157_2: R157.2 U19.6(~{OE})
NetR160_2: R160.2 U19.5(I2CEN)
NetR163_2: R163.2 U19.25(OVS)

Not connected (* = marked no-connect by the designer): J23 14(Utility_/_HEAC+); J24 14(Utility_/_HEAC+); U20 4(NC)

### Layout directives
net class HDMI_FPGA_TX: HDMI_FPGA_C_TX0_N, HDMI_FPGA_C_TX0_P, HDMI_FPGA_C_TX1_N, HDMI_FPGA_C_TX1_P, HDMI_FPGA_C_TX2_N, HDMI_FPGA_C_TX2_P, HDMI_FPGA_C_TXC_N, HDMI_FPGA_C_TXC_P, HDMI_FPGA_C_TXSCL, HDMI_FPGA_C_TXSDA, HDMI_FPGA_LS_TXHPD, HDMI_FPGA_TXCEC
net class HDMI_FPGA_RX: HDMI_FPGA_C_RX0_N, HDMI_FPGA_C_RX0_P, HDMI_FPGA_C_RX1_N, HDMI_FPGA_C_RX1_P, HDMI_FPGA_C_RX2_N, HDMI_FPGA_C_RX2_P, HDMI_FPGA_C_RXC_N, HDMI_FPGA_C_RXC_P, HDMI_FPGA_C_RXCEC, HDMI_FPGA_C_RXHPD, HDMI_FPGA_C_RXSCL, HDMI_FPGA_C_RXSDA
differential pair; net class Diff100: HDMI_FPGA_C_RX0_N, HDMI_FPGA_C_RX0_P, HDMI_FPGA_C_RX1_N, HDMI_FPGA_C_RX1_P, HDMI_FPGA_C_RX2_N, HDMI_FPGA_C_RX2_P, HDMI_FPGA_C_RXC_N, HDMI_FPGA_C_RXC_P, HDMI_FPGA_C_TX0_N, HDMI_FPGA_C_TX0_P, HDMI_FPGA_C_TX1_N, HDMI_FPGA_C_TX1_P, HDMI_FPGA_C_TX2_N, HDMI_FPGA_C_TX2_P, HDMI_FPGA_C_TXC_N, HDMI_FPGA_C_TXC_P, HDMI_FPGA_RX0_N, HDMI_FPGA_RX0_P, HDMI_FPGA_RX1_N, HDMI_FPGA_RX1_P, HDMI_FPGA_RX2_N, HDMI_FPGA_RX2_P, HDMI_FPGA_RXC_N, HDMI_FPGA_RXC_P, HDMI_FPGA_TX0_N, HDMI_FPGA_TX0_P, HDMI_FPGA_TX1_N, HDMI_FPGA_TX1_P, HDMI_FPGA_TX2_N, HDMI_FPGA_TX2_P, HDMI_FPGA_TXC_N, HDMI_FPGA_TXC_P
net class FPGA_HDMI_TX: HDMI_FPGA_TX0_N, HDMI_FPGA_TX0_P, HDMI_FPGA_TX1_N, HDMI_FPGA_TX1_P, HDMI_FPGA_TX2_N, HDMI_FPGA_TX2_P, HDMI_FPGA_TXC_N, HDMI_FPGA_TXC_P, HDMI_FPGA_TXCEC, HDMI_FPGA_TXHPD, HDMI_FPGA_TXSCL, HDMI_FPGA_TXSDA
net class FPGA_HDMI_RX: HDMI_FPGA_RX0_N, HDMI_FPGA_RX0_P, HDMI_FPGA_RX1_N, HDMI_FPGA_RX1_P, HDMI_FPGA_RX2_N, HDMI_FPGA_RX2_P, HDMI_FPGA_RXC_N, HDMI_FPGA_RXC_P, HDMI_FPGA_RXCEC, HDMI_FPGA_RXHPD, HDMI_FPGA_RXSCL, HDMI_FPGA_RXSDA

### Notes on the sheet
- FPGA-HDMI Output
- FPGA-HDMI Input
- Company:
- Contact:
- Customer:
- mail@pcb-arts.com
- PCB Arts GmbH
- Title:
- Project:
- The  information  contained  in  these  documents  is  confidential,  privileged  and  only  for  the information of the intended recipient and may not be used, published or redistributed Without the prior written consent from PCB Arts GmbH.
- Engineer:
- Document Number:
- Revision:
- Variant:
- Date:
- Time:
- Sheet:
- Status:
- /
- (in symbol CAP_0402_100nF_50V) X7R; 0402
- (in symbol CAP_0603_10µF_6.3V) X5R; 0603
- (in symbol CAP_0603_22µF_10V) X5R; 0603
- (in symbol CAP_0805_10µF_35V) X5R; 0805
- (in symbol CAP_1210_22µF_25V) X5R; 1210
- (in symbol EB-500-6007_HDMI Connector 19Pin Vertical THT) HDMI
- (in symbol RES_0402_1.6k_1%) 0402
- (in symbol RES_0402_4.64k_1%) 0402
- (in symbol RES_0402_10k_1%) 0402
- (in symbol RES_0402_30.1k_1%) 0402
- (in symbol RES_0402_47k_1%) 0402
- (in symbol RES_0402_100k_1%) 0402

### Library data of the parts
C167-C173 C176 C177 C179 C181 C183 C184 = CAP_0402_100nF_50V: as C15 on sheet DDR3 Memory_SO-DIMM; Manufacturer 2: TDK
C174 C175 = CAP_0603_10µF_6.3V: Multilayer Ceramic Capacitors MLCC - SMD/SMT 0603 6.3VDC; Manufacturer 1: Murata Electronics; Manufacturer 1 Prt. Nr.: GRM188R60J106ME84J; Manufacturer 2 Prt. Nr.: JMK107ABJ106MA-T; Manufacturer 2: Taiyo Yuden
C178 = CAP_1210_22µF_25V: Multilayer Ceramic Capacitors MLCC - SMD/SMT 1210 25VDC; Manufacturer 1: KEMET; Manufacturer 1 Prt. Nr.: C1210C226K3PACTU; Manufacturer 2 Prt. Nr.: TMK212BBJ226MG-TT; Manufacturer 2: Taiyo Yuden
C180 = CAP_0805_10µF_35V: as C37 on sheet DDR3 Memory_SO-DIMM; Manufacturer 2: TDK
C182 = CAP_0603_22µF_10V: Multilayer Ceramic Capacitors MLCC - SMD/SMT 0603 10VDC; Manufacturer 1: Samsung Electro-Mechanics; Manufacturer 1 Prt. Nr.: CL10A226MP8NUNE; Manufacturer 2 Prt. Nr.: GRM188R61A226ME15D; Manufacturer 2: Murata Electronics
D35 D36 D38-D48 D51-D63 = CESDP0402UC5VB_TVS Diode 0402: Low Capacitance ESD Protection Diode 0402; Manufacturer 1: CREATEK; Manufacturer 2 Prt. Nr.: BPESD0402-05ST; Manufacturer 1 Prt. Nr.: CESDP0402UC5VB; Manufacturer 2: BORN
D37 D49 D50 = BAT54GWJ_Schottky Diode 30V, 200mA: Schottky Diode 30V, 200mA; Manufacturer 1: Nexperia; Manufacturer 2 Prt. Nr.: BAT54T1G; Manufacturer 1 Prt. Nr.: BAT54GWJ; Manufacturer 2: onsemi
J23 J24 = EB-500-6007_HDMI Connector 19Pin Vertical THT: HDMI Connector Female Vertical 19 Pin; Manufacturer 1: Elecbee; Manufacturer 1 Prt. Nr.: EB-500-6007
L13 = BLM18SG121TN1D_Ferrite Beads 0603 120Ohms 3000mA: Ferritperlen BLM18_xN 0603 100MHz 120Ohm 3000mA 25mOhm RSER; Manufacturer 1: Murata Electronics; Manufacturer 1 Prt. Nr.: BLM18SG121TN1D
Q9-Q11 = 2N7002NXAKR_MOSFET 60V SGL N-CH TRENCHMOS: MOSFET 60V SGL N-CH TRENCHMOS; Manufacturer 1: Nexperia; Manufacturer 1 Prt. Nr.: 2N7002NXAKR
R151 = RES_0402_30.1k_1%: Thick Film Resistors - SMD 30.1kOhm 1%; Manufacturer 1: Vishay / Dale; Manufacturer 1 Prt. Nr.: CRCW040230K1FKEDC; Manufacturer 2 Prt. Nr.: RC0402FR-1330K1L; Manufacturer 2: Yageo
R152 = RES_0402_4.64k_1%: Thick Film Resistors - SMD 4.64kOhm 1%; Manufacturer 1: Vishay / Dale; Manufacturer 1 Prt. Nr.: CRCW04024K64FKEDC; Manufacturer 2 Prt. Nr.: RC0402FR-134K64L; Manufacturer 2: Yageo
R153 R154 R158 R159 R168 R169 R172 = RES_0402_1.6k_1%: Thick Film Resistors - SMD 1.6kOhm 1%; Manufacturer 1: Vishay / Dale; Manufacturer 1 Prt. Nr.: CRCW04021K60FKEDC; Manufacturer 2 Prt. Nr.: RC0402FR-7W1K6L; Manufacturer 2: Yageo
R155-R157 R160 R163 = RES_0402_10k_1%: Thick Film Resistors - SMD 10kOhm 1%; Manufacturer 1: Vishay / Dale; Manufacturer 1 Prt. Nr.: CRCW040210K0FKEDC; Manufacturer 2 Prt. Nr.: RC0402FR-7W10KL; Manufacturer 2: Yageo
R161 R162 = RES_0402_100k_1%: Thick Film Resistors - SMD 100kOhm 1%; Manufacturer 1: Vishay / Dale; Manufacturer 1 Prt. Nr.: CRCW0402100KFKEDC; Manufacturer 2 Prt. Nr.: RC0402FR-7W100KL; Manufacturer 2: Yageo
R164-R167 R170 R171 = RES_0402_47k_1%: Thick Film Resistors - SMD 47kOhm 1%; Manufacturer 1: Vishay / Dale; Manufacturer 1 Prt. Nr.: CRCW040247K0FKEDC; Manufacturer 2 Prt. Nr.: RC0402FR-7W47KL; Manufacturer 2: Yageo
U19 = TMDS141RHAR_HDMI Hider, 130 mA, 6 kV, 0 to +70 degC, 40-pin QFN: HDMI Hider, 130 mA, 6 kV, 0 to +70 degC, 40-pin QFN; Manufacturer 1: Texas Instruments; ComponentLink2Description: Datasheet; ComponentLink1URL: http://www.ti.com/; ComponentLink2URL: http://www.ti.com/general/docs/lit/getliterature.tsp?genericPartNumber=TMDS141&fileType=pdf; ComponentLink3Description: URL Link1; ComponentLink1Description: Manufacturer URL; Manufacturer 1 Prt. Nr.: TMDS141RHAR; ComponentLink3URL: SamplesURL:http://www.ti.com/product/tmds141#samples
U20 = AP21510FM-7_Power Switch ICs - Power Distribution Load Switch: Power Switch ICs - Power Distribution 0.5A SGL Ch USB 2.0 Curr Limited Switch; Manufacturer 1: Diodes Incorporated; Manufacturer 1 Prt. Nr.: AP21510FM-7
U21 = AD8195ACPZ_IC VIDEO HDMI/DVI BUFFER 40LFCSP: IC VIDEO HDMI/DVI BUFFER 40LFCSP; Manufacturer 1: Analog Devices; Manufacturer 1 Prt. Nr.: AD8195ACPZ

## Sheet HMI.SchDoc
size A3; SheetNumber: 19; SheetTotal: 32
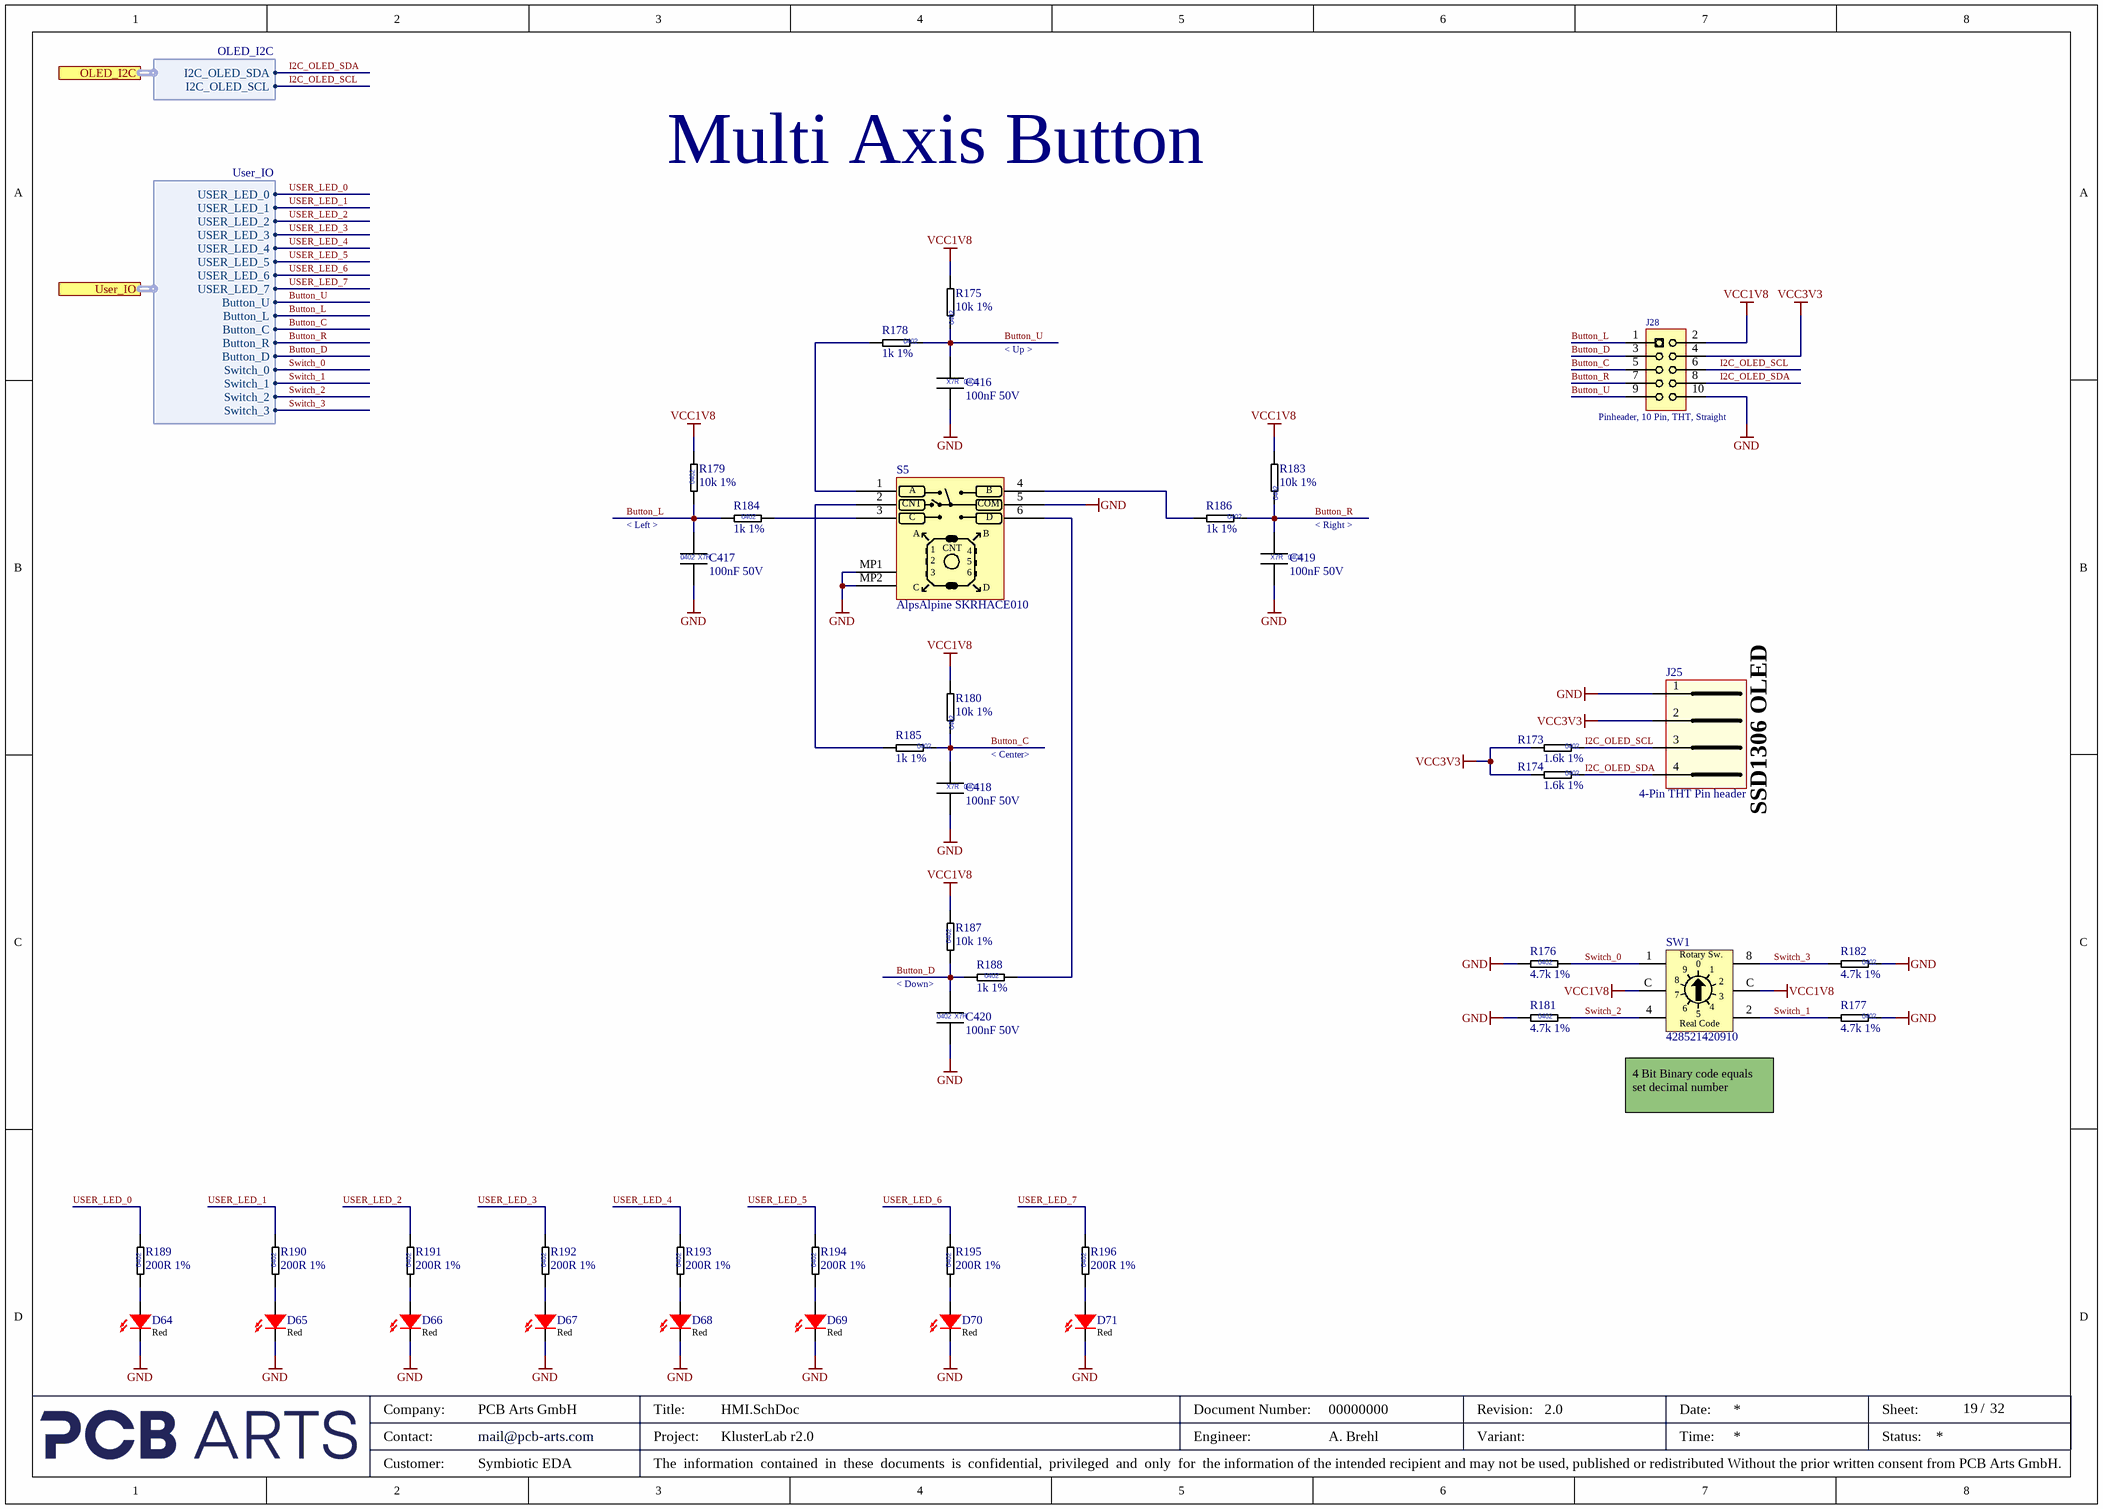
[diagram p6: HMI.SchDoc]

### Parts
C416  100nF 50V  [CAP_0402_L]
C417  100nF 50V  [CAP_0402_L]
C418  100nF 50V  [CAP_0402_L]
C419  100nF 50V  [CAP_0402_L]
C420  100nF 50V  [CAP_0402_L]
D64  Color: Red  [LED-0603 Sideview]  (hidden comment: LTST-S270KRKT)
D65  Color: Red  [LED-0603 Sideview]  (hidden comment: LTST-S270KRKT)
D66  Color: Red  [LED-0603 Sideview]  (hidden comment: LTST-S270KRKT)
D67  Color: Red  [LED-0603 Sideview]  (hidden comment: LTST-S270KRKT)
D68  Color: Red  [LED-0603 Sideview]  (hidden comment: LTST-S270KRKT)
D69  Color: Red  [LED-0603 Sideview]  (hidden comment: LTST-S270KRKT)
D70  Color: Red  [LED-0603 Sideview]  (hidden comment: LTST-S270KRKT)
D71  Color: Red  [LED-0603 Sideview]  (hidden comment: LTST-S270KRKT)
J25  4-Pin THT Pin header  [61300411121]
J28  Pinheader, 10 Pin, THT, Straight  [62701021621]
R173  1.6k 1%  [RES_0402_L]
R174  1.6k 1%  [RES_0402_L]
R175  10k 1%  [RES_0402_L]
R176  4.7k 1%  [RES_0402_L]
R177  4.7k 1%  [RES_0402_L]
R178  1k 1%  [RES_0402_L]
R179  10k 1%  [RES_0402_L]
R180  10k 1%  [RES_0402_L]
R181  4.7k 1%  [RES_0402_L]
R182  4.7k 1%  [RES_0402_L]
R183  10k 1%  [RES_0402_L]
R184  1k 1%  [RES_0402_L]
R185  1k 1%  [RES_0402_L]
R186  1k 1%  [RES_0402_L]
R187  10k 1%  [RES_0402_L]
R188  1k 1%  [RES_0402_L]
R189  200R 1%  [RES_0402_L]
R190  200R 1%  [RES_0402_L]
R191  200R 1%  [RES_0402_L]
R192  200R 1%  [RES_0402_L]
R193  200R 1%  [RES_0402_L]
R194  200R 1%  [RES_0402_L]
R195  200R 1%  [RES_0402_L]
R196  200R 1%  [RES_0402_L]
S5  AlpsAlpine SKRHACE010  [AlpsAlpine_SKRHACE010]
SW1  428521420910  [WÜRTH 428521420910]

### Ports
OLED_I2C (harness OLED_I2C, see Top-Level-Sheet[6C], I2C Multiplexer[7B]), User_IO (harness User_IO, see Top-Level-Sheet[6C], Bank 0_Bank 14[8B])

### Harnesses
OLED_I2C: I2C_OLED_SDA, I2C_OLED_SCL
User_IO: USER_LED_0, USER_LED_1, USER_LED_2, USER_LED_3, USER_LED_4, USER_LED_5, USER_LED_6, USER_LED_7, Switch_0, Switch_1, Switch_2, Switch_3, Button_L, Button_U, Button_C, Button_R, Button_D

### Nets
GND: C416.2 C417.2 C418.2 C419.2 C420.2 D64.1 D65.1 D66.1 D67.1 D68.1 D69.1 D70.1 D71.1 J25.1 J28.10 R176.1 R177.1 R181.1 R182.1 S5.5 S5.MP1 S5.MP2
VCC1V8: J28.2 R175.2 R179.2 R180.2 R183.2 R187.2 SW1.C
VCC3V3: J25.2 J28.4 R173.2 R174.2
Button_C: C418.1 J28.5 R180.1 R185.1 ; port User_IO.Button_C
Button_D: C420.1 J28.3 R187.1 R188.1 ; port User_IO.Button_D
Button_L: C417.1 J28.1 R179.1 R184.1 ; port User_IO.Button_L
Button_R: C419.1 J28.7 R183.1 R186.1 ; port User_IO.Button_R
Button_U: C416.1 J28.9 R175.1 R178.1 ; port User_IO.Button_U
I2C_OLED_SCL: J25.3 J28.6 R173.1 ; port OLED_I2C.I2C_OLED_SCL
I2C_OLED_SDA: J25.4 J28.8 R174.1 ; port OLED_I2C.I2C_OLED_SDA
Switch_0: R176.2 SW1.1 ; port User_IO.Switch_0
Switch_1: R177.2 SW1.2 ; port User_IO.Switch_1
Switch_2: R181.2 SW1.4 ; port User_IO.Switch_2
Switch_3: R182.2 SW1.8 ; port User_IO.Switch_3
USER_LED_0: R189.2 ; port User_IO.USER_LED_0
USER_LED_1: R190.2 ; port User_IO.USER_LED_1
USER_LED_2: R191.2 ; port User_IO.USER_LED_2
USER_LED_3: R192.2 ; port User_IO.USER_LED_3
USER_LED_4: R193.2 ; port User_IO.USER_LED_4
USER_LED_5: R194.2 ; port User_IO.USER_LED_5
USER_LED_6: R195.2 ; port User_IO.USER_LED_6
USER_LED_7: R196.2 ; port User_IO.USER_LED_7
NetD64_2: D64.2 R189.1
NetD65_2: D65.2 R190.1
NetD66_2: D66.2 R191.1
NetD67_2: D67.2 R192.1
NetD68_2: D68.2 R193.1
NetD69_2: D69.2 R194.1
NetD70_2: D70.2 R195.1
NetD71_2: D71.2 R196.1
NetR178_2: R178.2 S5.1
NetR184_2: R184.2 S5.3
NetR185_2: R185.2 S5.2
NetR186_2: R186.2 S5.4
NetR188_2: R188.2 S5.6

### Notes on the sheet
- Multi Axis Button
- < Up >
- < Left >
- < Right >
- < Center>
- SSD1306 OLED
- < Down>
- (near SW1) 4 Bit Binary code equals set decimal number
- Company:
- Contact:
- Customer:
- mail@pcb-arts.com
- PCB Arts GmbH
- Title:
- Project:
- The  information  contained  in  these  documents  is  confidential,  privileged  and  only  for  the information of the intended recipient and may not be used, published or redistributed Without the prior written consent from PCB Arts GmbH.
- Engineer:
- Document Number:
- Revision:
- Variant:
- Date:
- Time:
- Sheet:
- Status:
- /
- (in symbol 428521420910_Rotary Switch WS-ROSV 10Pos Real Code) Rotary Sw.; 0; 9; 7; 3; 6; 5; Real Code
- (in symbol AlpsAlpine_ SKRHACE010_Multi-Directional-Switches_4-directions_center-push) A; B; CNT; COM; C; D
- (in symbol CAP_0402_100nF_50V) 0402; X7R
- (in symbol RES_0402_1.6k_1%) 0402
- (in symbol RES_0402_1k_1%) 0402
- (in symbol RES_0402_4.7k_1%) 0402
- (in symbol RES_0402_10k_1%) 0402
- (in symbol RES_0402_200R 1%) 0402

### Library data of the parts
C416-C420 = CAP_0402_100nF_50V: as C15 on sheet DDR3 Memory_SO-DIMM; Manufacturer 2: TDK
D64-D71 = LED 0603 Red Sideview: RED  0603 Light Emitting Diode; Manufacturer 1: lite-On; Manufacturer 1 Prt. Nr.: LTST-S270KRKT
J25 = 61300411121_WR-PHD 2.54mm 4Pin THT Header: WR-PHD 2.54mm 4Pin THT Header; Manufacturer 1: Würth Elektronik; Manufacturer 1 Prt. Nr.: 61300411121
J28 = 62701021621_Box Pin header THT 1.27mm 10Pol Straight: Box Pin header THT 1.27mm 10Pol Straight; Manufacturer 1: Würth Elektronik; Manufacturer 1 Prt. Nr.: 62701021621
R173 R174 = RES_0402_1.6k_1%: as R153 on sheet FPGA_HDMI_IN_OUT; Manufacturer 2: Yageo
R175 R179 R180 R183 R187 = RES_0402_10k_1%: as R155-R157 on sheet FPGA_HDMI_IN_OUT; Manufacturer 2: Yageo
R176 R177 R181 R182 = RES_0402_4.7k_1%: as R10-R15 on sheet DDR3 Memory_SO-DIMM; Manufacturer 2: Yageo
R178 R184-R186 R188 = RES_0402_1k_1%: Thick Film Resistors - SMD 1kOhm 1%; Manufacturer 1: Vishay / Dale; Manufacturer 1 Prt. Nr.: CRCW04021K00FKEDC; Manufacturer 2 Prt. Nr.: RC0402FR-7W1KL; Manufacturer 2: Yageo
R189-R196 = RES_0402_200R 1%: Thick Film Resistors - SMD 200Ohm 1%; Manufacturer 1: Vishay / Dale; Manufacturer 1 Prt. Nr.: CRCW0402200RFKEDC; Manufacturer 2 Prt. Nr.: AF0402FR-07200RL; Manufacturer 2: Yageo
S5 = AlpsAlpine_ SKRHACE010_Multi-Directional-Switches_4-directions_center-push: Multi-Directional Switches, 4-directions, center-push; Manufacturer 1 Prt. Nr.: SKRHACE010; Manufacturer 1: Alps Alpine
SW1 = 428521420910_Rotary Switch WS-ROSV 10Pos Real Code: Rotary Switches WS-ROSV IP67 10Pos 2.54mm Lt Grey; Manufacturer 1: Würth Elektronik; Manufacturer 1 Prt. Nr.: 428521420910

## Sheet MGT Banks 115-116.SchDoc
size A3; SheetNumber: 22; SheetTotal: 32
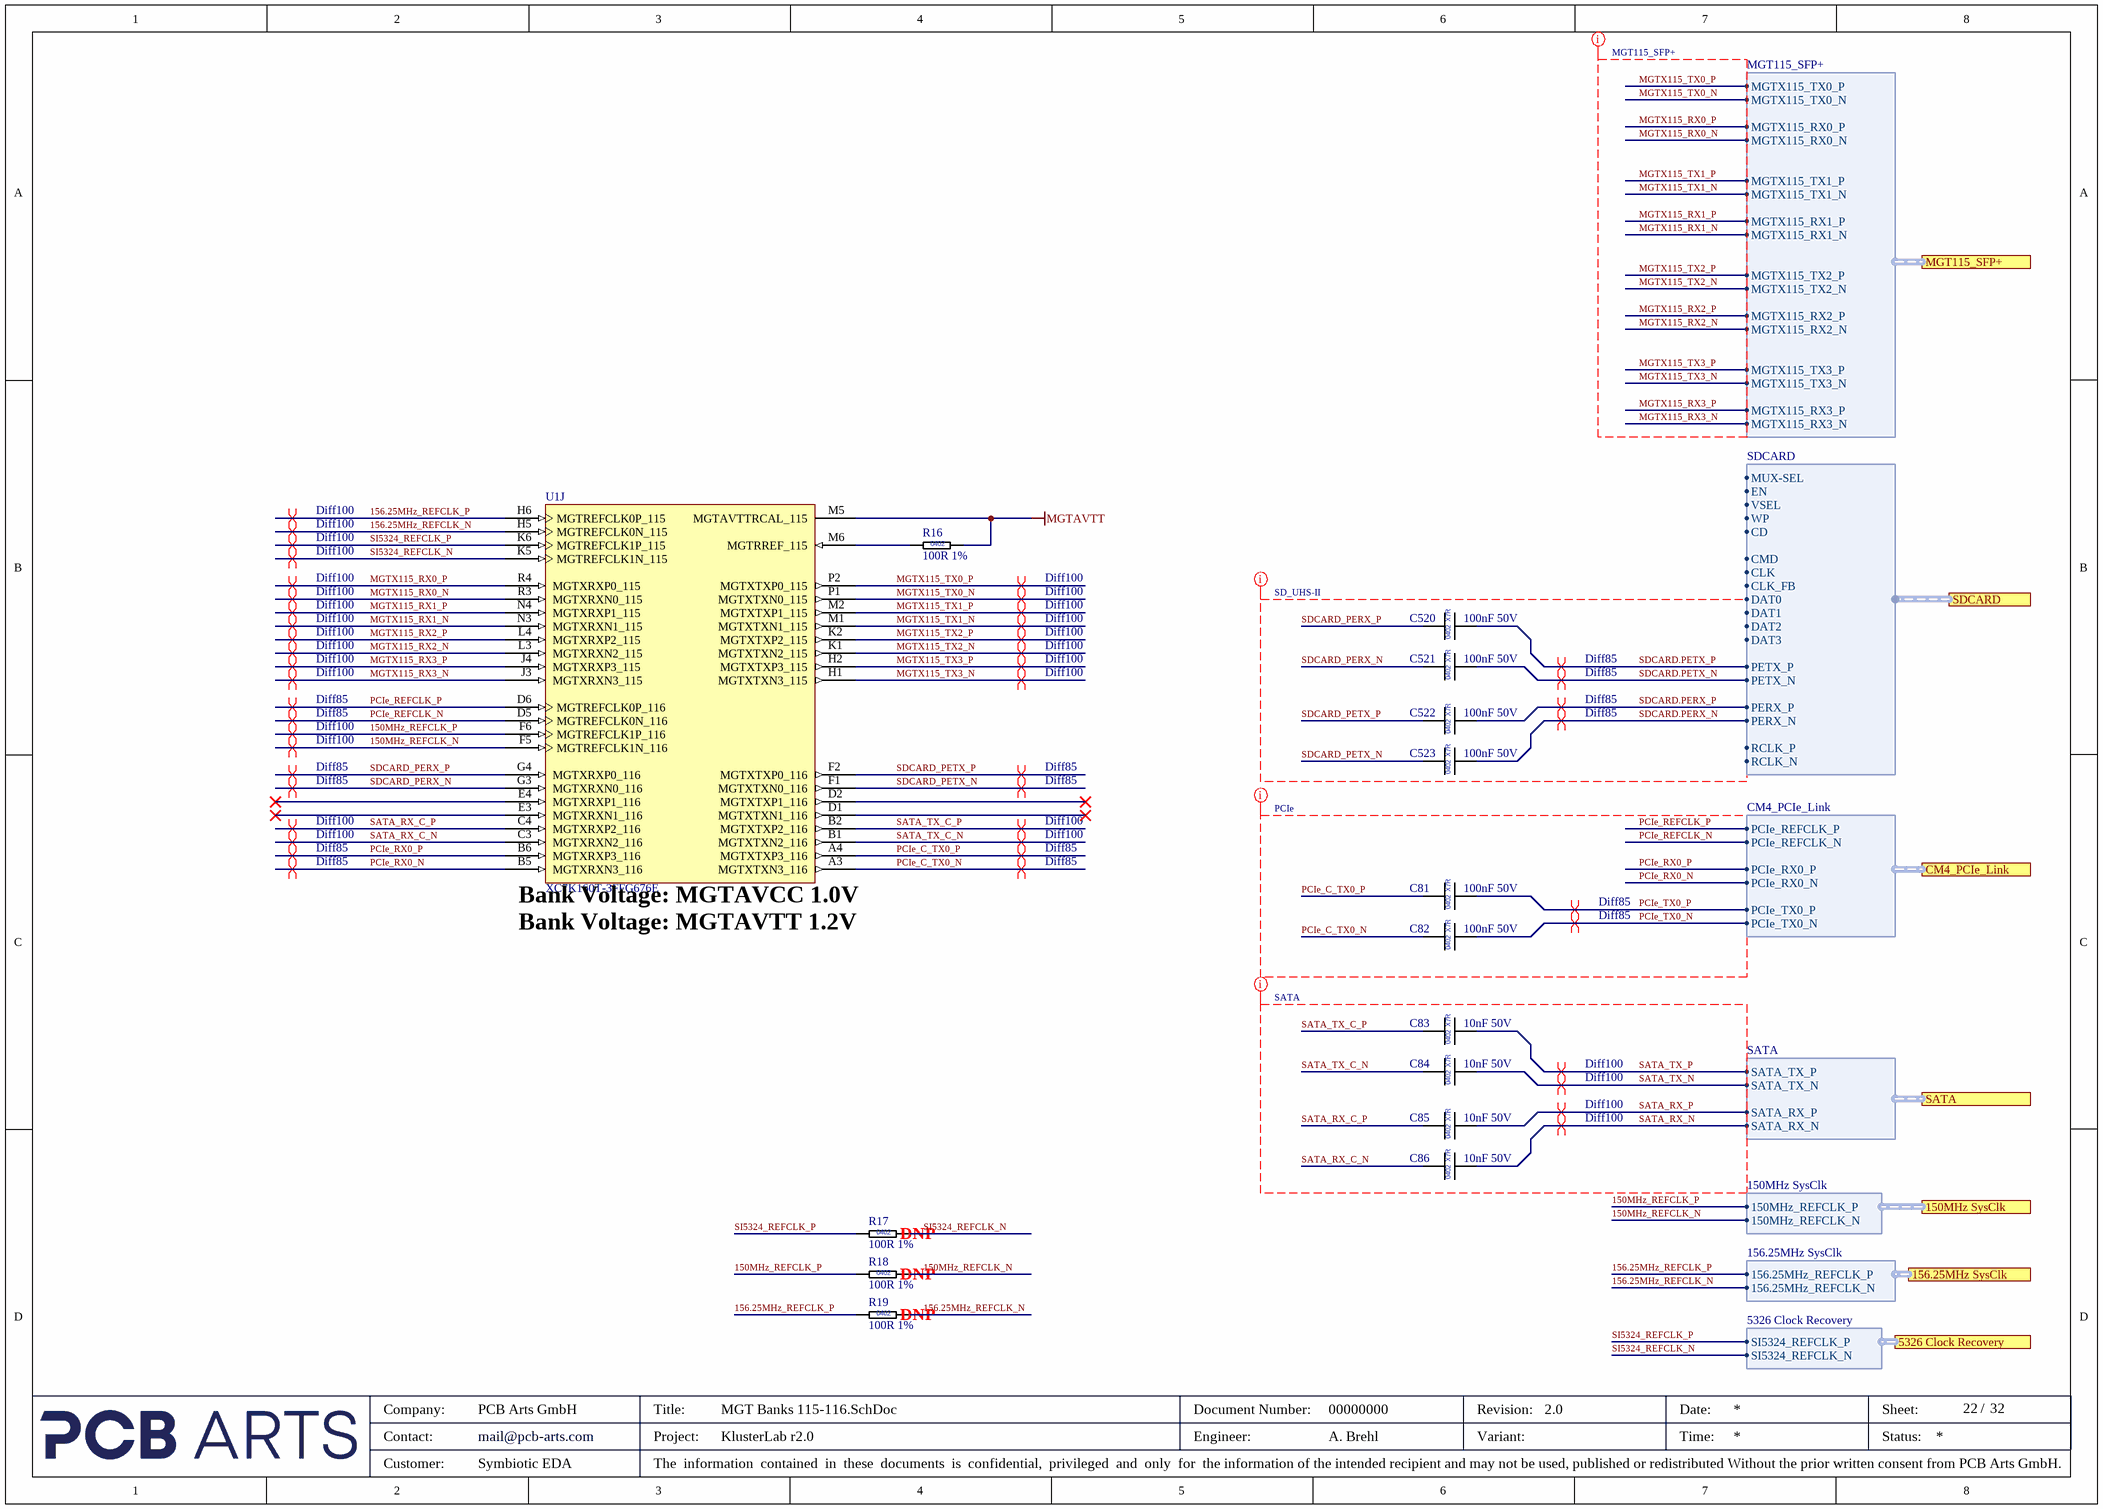
[diagram p7: MGT Banks 115-116.SchDoc]

### Parts
C81  100nF 50V  [CAP_0402_L]
C82  100nF 50V  [CAP_0402_L]
C83  10nF 50V  [CAP_0402_L]
C84  10nF 50V  [CAP_0402_L]
C85  10nF 50V  [CAP_0402_L]
C86  10nF 50V  [CAP_0402_L]
C520  100nF 50V  [CAP_0402_L]
C521  100nF 50V  [CAP_0402_L]
C522  100nF 50V  [CAP_0402_L]
C523  100nF 50V  [CAP_0402_L]
R16  100R 1%  [RES_0402_L]
R17  100R 1%  [RES_0402_L]  (no BOM)
R18  100R 1%  [RES_0402_L]  (no BOM)
R19  100R 1%  [RES_0402_L]  (no BOM)
U1  XC7K160T-3FFG676E  [BGA100P2700X2700X317-676N]  (part J of 14)

### Ports
150MHz SysClk (harness 150MHz SysClk, see Top-Level-Sheet[5B], System Clocks[8A]), 156.25MHz SysClk (harness 156.25MHz SysClk, see Top-Level-Sheet[5B], System Clocks[8A]), 5326 Clock Recovery (harness 5326 Clock Recovery, see Top-Level-Sheet[5B], System Clocks[8A]), CM4_PCIe_Link (harness CM4_PCIe_Link, see Top-Level-Sheet[5B], Raspberry Pi CM4[8B]), MGT115_SFP+ (harness MGT115_SFP+, see Top-Level-Sheet[5B], SFP+_Connectors[8A]), SATA (harness SATA, see Top-Level-Sheet[5B], SSD M.2_B-Key[8A]), SDCARD (harness SDCARD, see Top-Level-Sheet[5B], Memory-SD_UHS_II[1C], SMI Bank 12[1B])

### Harnesses
MGT115_SFP+: MGTX115_TX0_P, MGTX115_TX0_N, MGTX115_RX0_P, MGTX115_RX0_N, MGTX115_TX1_P, MGTX115_TX1_N, MGTX115_RX1_P, MGTX115_RX1_N, MGTX115_TX2_P, MGTX115_TX2_N, MGTX115_RX2_P, MGTX115_RX2_N, MGTX115_TX3_P, MGTX115_TX3_N, MGTX115_RX3_P, MGTX115_RX3_N
SATA: SATA_TX_P, SATA_TX_N, SATA_RX_P, SATA_RX_N
CM4_PCIe_Link: PCIe_REFCLK_P, PCIe_REFCLK_N, PCIe_RX0_P, PCIe_RX0_N, PCIe_TX0_P, PCIe_TX0_N
150MHz SysClk: 150MHz_REFCLK_P, 150MHz_REFCLK_N
5326 Clock Recovery: SI5324_REFCLK_P, SI5324_REFCLK_N
156.25MHz SysClk: 156.25MHz_REFCLK_P, 156.25MHz_REFCLK_N
SDCARD: MUX-SEL, EN, VSEL, WP, CD, CMD, CLK, CLK_FB, PETX_P, PETX_N, DAT0, DAT1, DAT2, DAT3, PERX_P, PERX_N, RCLK_P, RCLK_N

### Nets
MGTAVTT: R16.2 U1.M5(MGTAVTTRCAL_115)
150MHz_REFCLK_N: R18.2 U1.F5(MGTREFCLK1N_116) ; port 150MHz SysClk.150MHz_REFCLK_N
150MHz_REFCLK_P: R18.1 U1.F6(MGTREFCLK1P_116) ; port 150MHz SysClk.150MHz_REFCLK_P
156.25MHz_REFCLK_N: R19.2 U1.H5(MGTREFCLK0N_115) ; port 156.25MHz SysClk.156.25MHz_REFCLK_N
156.25MHz_REFCLK_P: R19.1 U1.H6(MGTREFCLK0P_115) ; port 156.25MHz SysClk.156.25MHz_REFCLK_P
MGTX115_RX0_N: U1.R3(MGTXRXN0_115) ; port MGT115_SFP+.MGTX115_RX0_N
MGTX115_RX0_P: U1.R4(MGTXRXP0_115) ; port MGT115_SFP+.MGTX115_RX0_P
MGTX115_RX1_N: U1.N3(MGTXRXN1_115) ; port MGT115_SFP+.MGTX115_RX1_N
MGTX115_RX1_P: U1.N4(MGTXRXP1_115) ; port MGT115_SFP+.MGTX115_RX1_P
MGTX115_RX2_N: U1.L3(MGTXRXN2_115) ; port MGT115_SFP+.MGTX115_RX2_N
MGTX115_RX2_P: U1.L4(MGTXRXP2_115) ; port MGT115_SFP+.MGTX115_RX2_P
MGTX115_RX3_N: U1.J3(MGTXRXN3_115) ; port MGT115_SFP+.MGTX115_RX3_N
MGTX115_RX3_P: U1.J4(MGTXRXP3_115) ; port MGT115_SFP+.MGTX115_RX3_P
MGTX115_TX0_N: U1.P1(MGTXTXN0_115) ; port MGT115_SFP+.MGTX115_TX0_N
MGTX115_TX0_P: U1.P2(MGTXTXP0_115) ; port MGT115_SFP+.MGTX115_TX0_P
MGTX115_TX1_N: U1.M1(MGTXTXN1_115) ; port MGT115_SFP+.MGTX115_TX1_N
MGTX115_TX1_P: U1.M2(MGTXTXP1_115) ; port MGT115_SFP+.MGTX115_TX1_P
MGTX115_TX2_N: U1.K1(MGTXTXN2_115) ; port MGT115_SFP+.MGTX115_TX2_N
MGTX115_TX2_P: U1.K2(MGTXTXP2_115) ; port MGT115_SFP+.MGTX115_TX2_P
MGTX115_TX3_N: U1.H1(MGTXTXN3_115) ; port MGT115_SFP+.MGTX115_TX3_N
MGTX115_TX3_P: U1.H2(MGTXTXP3_115) ; port MGT115_SFP+.MGTX115_TX3_P
PCIe_C_TX0_N: C82.1 U1.A3(MGTXTXN3_116)
PCIe_C_TX0_P: C81.1 U1.A4(MGTXTXP3_116)
PCIe_REFCLK_N: U1.D5(MGTREFCLK0N_116) ; port CM4_PCIe_Link.PCIe_REFCLK_N
PCIe_REFCLK_P: U1.D6(MGTREFCLK0P_116) ; port CM4_PCIe_Link.PCIe_REFCLK_P
PCIe_RX0_N: U1.B5(MGTXRXN3_116) ; port CM4_PCIe_Link.PCIe_RX0_N
PCIe_RX0_P: U1.B6(MGTXRXP3_116) ; port CM4_PCIe_Link.PCIe_RX0_P
PCIe_TX0_N: C82.2 ; port CM4_PCIe_Link.PCIe_TX0_N
PCIe_TX0_P: C81.2 ; port CM4_PCIe_Link.PCIe_TX0_P
SATA_RX_C_N: C86.1 U1.C3(MGTXRXN2_116)
SATA_RX_C_P: C85.1 U1.C4(MGTXRXP2_116)
SATA_RX_N: C86.2 ; port SATA.SATA_RX_N
SATA_RX_P: C85.2 ; port SATA.SATA_RX_P
SATA_TX_C_N: C84.1 U1.B1(MGTXTXN2_116)
SATA_TX_C_P: C83.1 U1.B2(MGTXTXP2_116)
SATA_TX_N: C84.2 ; port SATA.SATA_TX_N
SATA_TX_P: C83.2 ; port SATA.SATA_TX_P
SDCARD.PERX_N: C523.2 ; port SDCARD.PERX_N
SDCARD.PERX_P: C522.2 ; port SDCARD.PERX_P
SDCARD.PETX_N: C521.2 ; port SDCARD.PETX_N
SDCARD.PETX_P: C520.2 ; port SDCARD.PETX_P
SDCARD_PERX_N: C521.1 U1.G3(MGTXRXN0_116)
SDCARD_PERX_P: C520.1 U1.G4(MGTXRXP0_116)
SDCARD_PETX_N: C523.1 U1.F1(MGTXTXN0_116)
SDCARD_PETX_P: C522.1 U1.F2(MGTXTXP0_116)
SI5324_REFCLK_N: R17.2 U1.K5(MGTREFCLK1N_115) ; port 5326 Clock Recovery.SI5324_REFCLK_N
SI5324_REFCLK_P: R17.1 U1.K6(MGTREFCLK1P_115) ; port 5326 Clock Recovery.SI5324_REFCLK_P
NetR16_1: R16.1 U1.M6(MGTRREF_115)

Not connected (* = marked no-connect by the designer): U1 D1(MGTXTXN1_116)* D2(MGTXTXP1_116)* E3(MGTXRXN1_116)* E4(MGTXRXP1_116)*

### Layout directives
differential pair; net class Diff100: 150MHz_REFCLK_N, 150MHz_REFCLK_P, 156.25MHz_REFCLK_N, 156.25MHz_REFCLK_P, MGTX115_RX0_N, MGTX115_RX0_P, MGTX115_RX1_N, MGTX115_RX1_P, MGTX115_RX2_N, MGTX115_RX2_P, MGTX115_RX3_N, MGTX115_RX3_P, MGTX115_TX0_N, MGTX115_TX0_P, MGTX115_TX1_N, MGTX115_TX1_P, MGTX115_TX2_N, MGTX115_TX2_P, MGTX115_TX3_N, MGTX115_TX3_P, SATA_RX_C_N, SATA_RX_C_P, SATA_RX_N, SATA_RX_P, SATA_TX_C_N, SATA_TX_C_P, SATA_TX_N, SATA_TX_P, SI5324_REFCLK_N, SI5324_REFCLK_P
differential pair; net class Diff85: PCIe_C_TX0_N, PCIe_C_TX0_P, PCIe_REFCLK_N, PCIe_REFCLK_P, PCIe_RX0_N, PCIe_RX0_P, PCIe_TX0_N, PCIe_TX0_P, SDCARD.PERX_N, SDCARD.PERX_P, SDCARD.PETX_N, SDCARD.PETX_P, SDCARD_PERX_N, SDCARD_PERX_P, SDCARD_PETX_N, SDCARD_PETX_P
net class PCIe: PCIe_C_TX0_N, PCIe_C_TX0_P, PCIe_REFCLK_N, PCIe_REFCLK_P, PCIe_RX0_N, PCIe_RX0_P, PCIe_TX0_N, PCIe_TX0_P
net class SATA: SATA_RX_C_N, SATA_RX_C_P, SATA_RX_N, SATA_RX_P, SATA_TX_C_N, SATA_TX_C_P, SATA_TX_N, SATA_TX_P
net class MGT115_SFP+: MGTX115_RX0_N, MGTX115_RX0_P, MGTX115_RX1_N, MGTX115_RX1_P, MGTX115_RX2_N, MGTX115_RX2_P, MGTX115_RX3_N, MGTX115_RX3_P, MGTX115_TX0_N, MGTX115_TX0_P, MGTX115_TX1_N, MGTX115_TX1_P, MGTX115_TX2_N, MGTX115_TX2_P, MGTX115_TX3_N, MGTX115_TX3_P
net class SD_UHS-II: SDCARD.PERX_N, SDCARD.PERX_P, SDCARD.PETX_N, SDCARD.PETX_P, SDCARD_PERX_N, SDCARD_PERX_P, SDCARD_PETX_N, SDCARD_PETX_P

### Notes on the sheet
- (near U1) Bank Voltage: MGTAVCC 1.0V
- (near U1) Bank Voltage: MGTAVTT 1.2V
- (near R17) DNP
- (near R18) DNP
- (near R19) DNP
- Company:
- Contact:
- Customer:
- mail@pcb-arts.com
- PCB Arts GmbH
- Title:
- Project:
- The  information  contained  in  these  documents  is  confidential,  privileged  and  only  for  the information of the intended recipient and may not be used, published or redistributed Without the prior written consent from PCB Arts GmbH.
- Engineer:
- Document Number:
- Revision:
- Variant:
- Date:
- Time:
- Sheet:
- Status:
- /
- (in symbol CAP_0402_10nF_50V) X7R; 0402
- (in symbol CAP_0402_100nF_50V) X7R; 0402
- (in symbol RES_0402_100R_1%) 0402

### Library data of the parts
C81 C82 C520-C523 = CAP_0402_100nF_50V: as C15 on sheet DDR3 Memory_SO-DIMM; Manufacturer 2: TDK
C83-C86 = CAP_0402_10nF_50V: as C16 on sheet DDR3 Memory_SO-DIMM; Manufacturer 2: Yageo
R16-R19 = RES_0402_100R_1%: Thick Film Resistors - SMD 100Ohm 1%; Manufacturer 1: Vishay / Dale; Manufacturer 1 Prt. Nr.: CRCW0402100RFKEE; Manufacturer 2 Prt. Nr.: RC0402FR-7W100RL; Manufacturer 2: Yageo
U1 = XC7K160T-3FFG676E_Kintex-7 FPGA, 400 User I/Os, 8 GTX, FFG676: Kintex-7 FPGA, 400 User I/Os, 8 GTX, 676-Ball BGA, Speed Grade 3, Extended Grade, Pb-Free; Manufacturer 1: Xilinx; Manufacturer 1 Prt. Nr.: XC7K160T-3FFG676E; ComponentLink1URL: http://www.xilinx.com/support/documentation/data_sheets/ds180_7Series_Overview.pdf; ComponentLink2URL: http://www.xilinx.com/support/documentation/user_guides/ug865-Zynq-7000-Pkg-Pinout.pdf; ComponentLink1Description: Datasheet; ComponentLink2Description: Package Specification